# Altium schematic sheet Sheet2.0.SchDoc
size A0
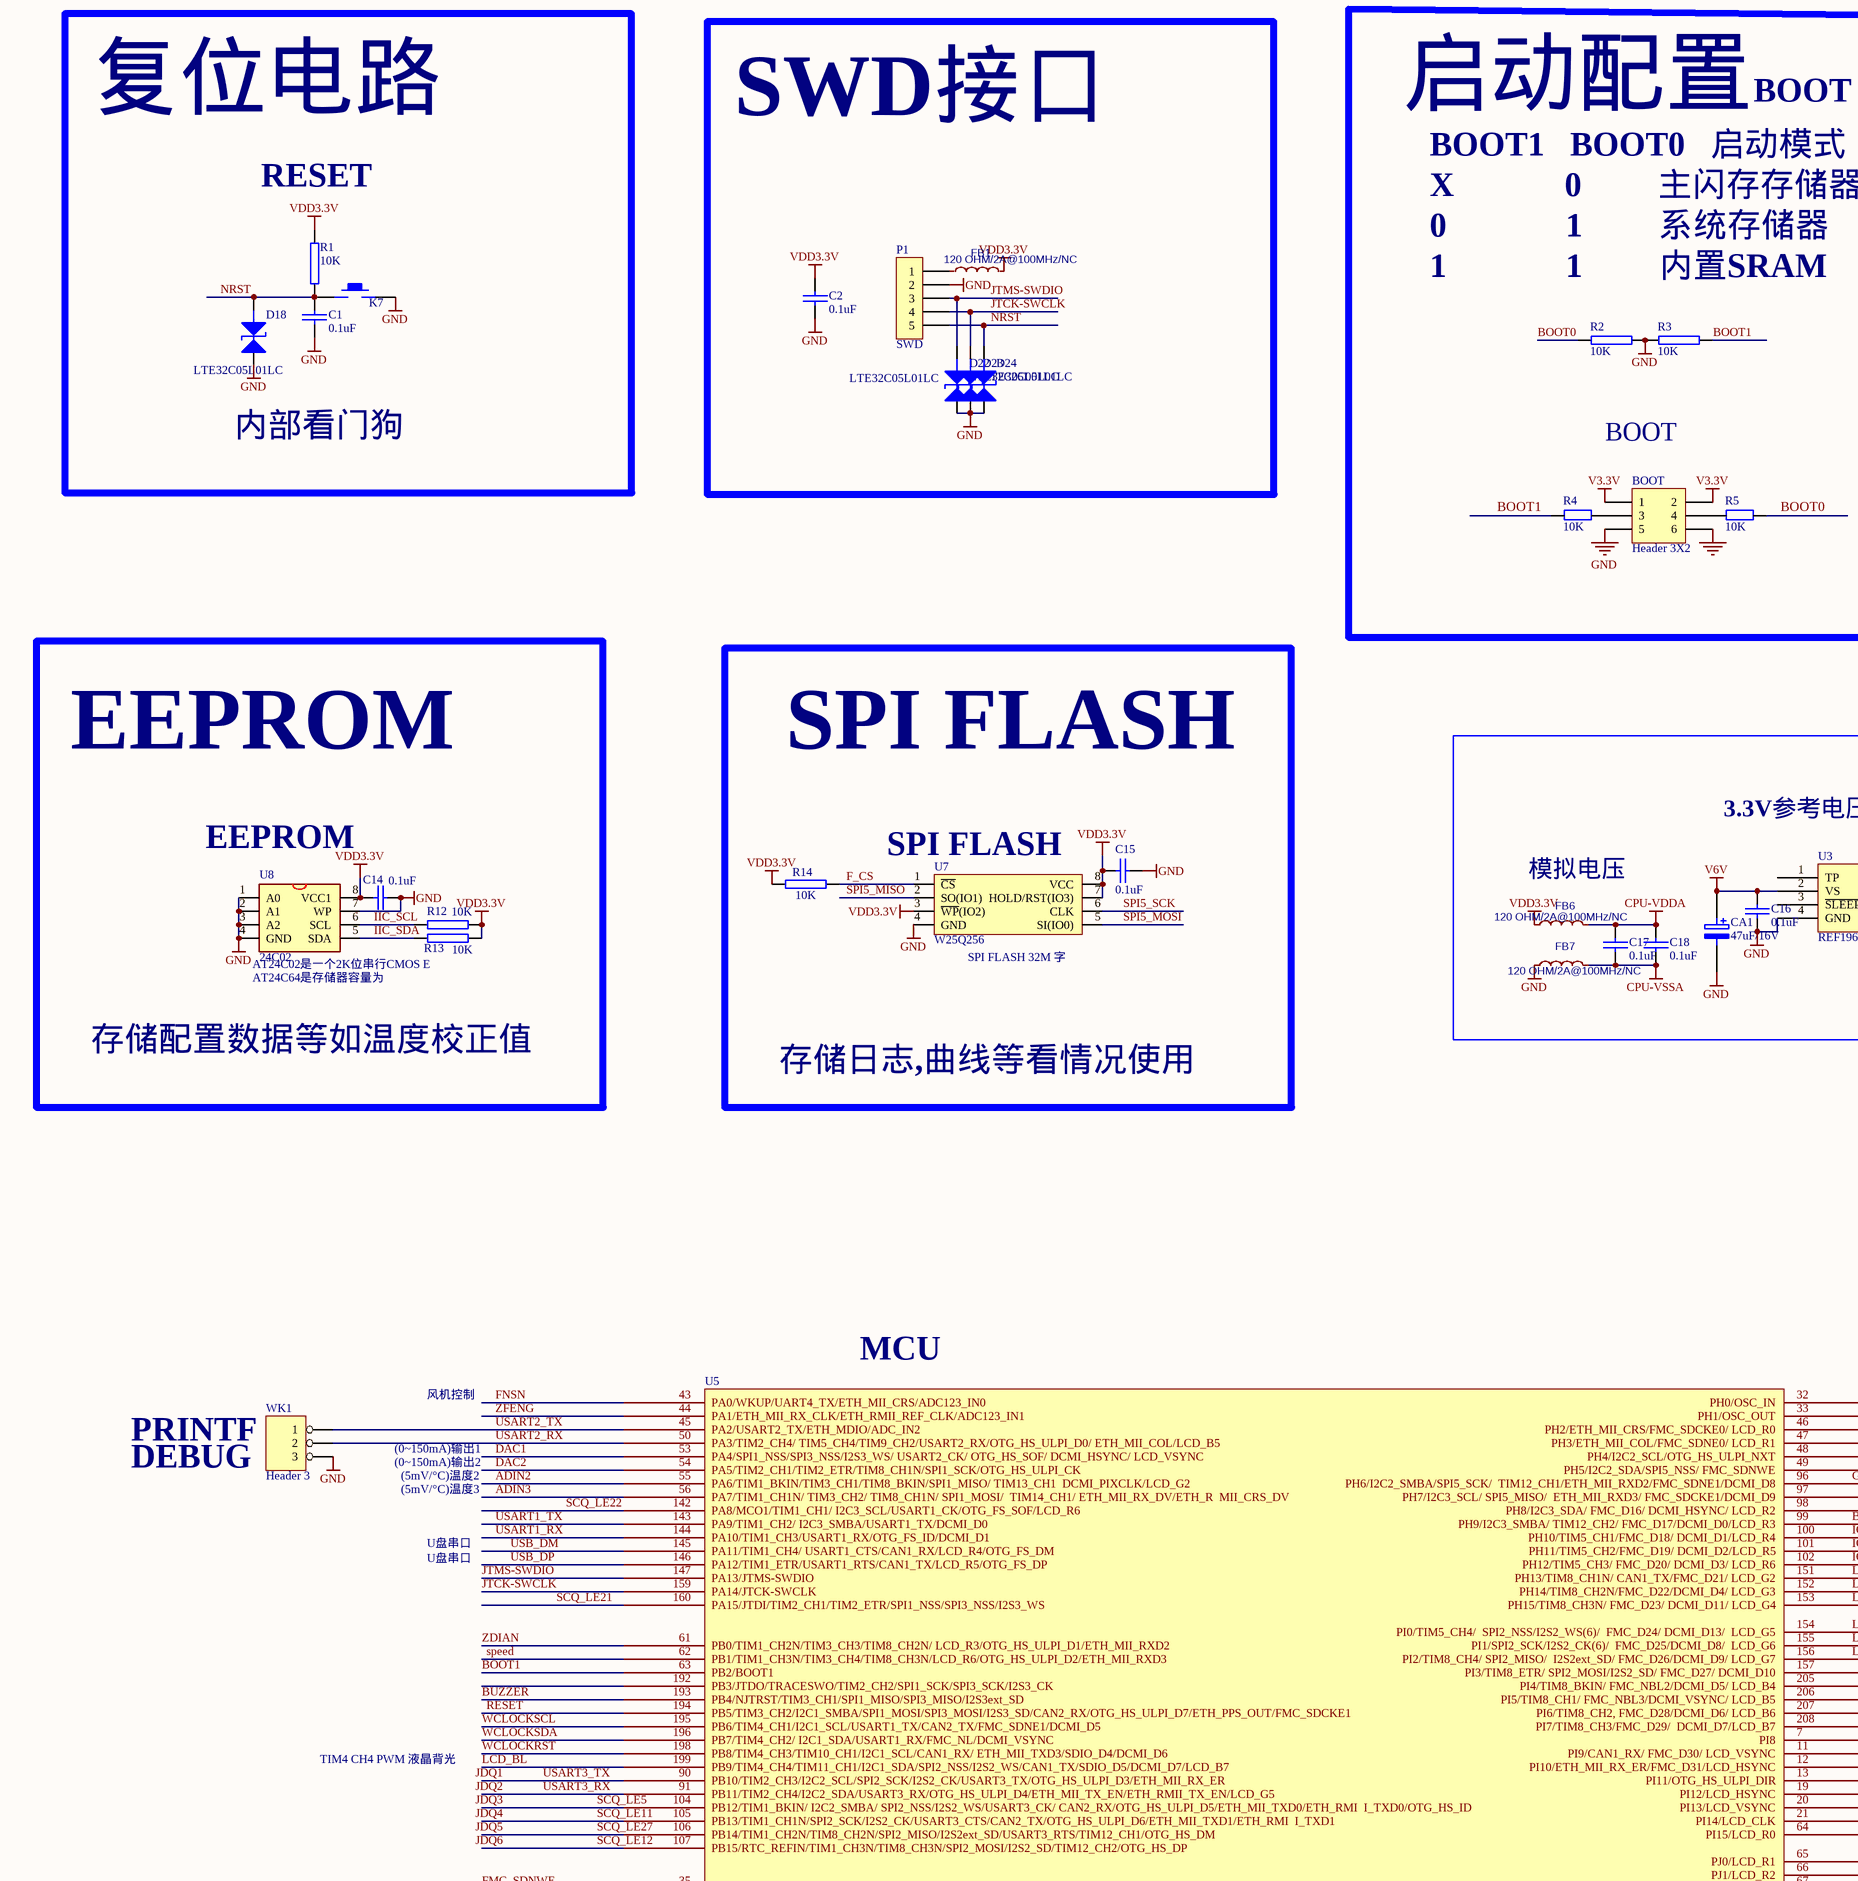
[diagram p0: Sheet2.0.SchDoc, top left]
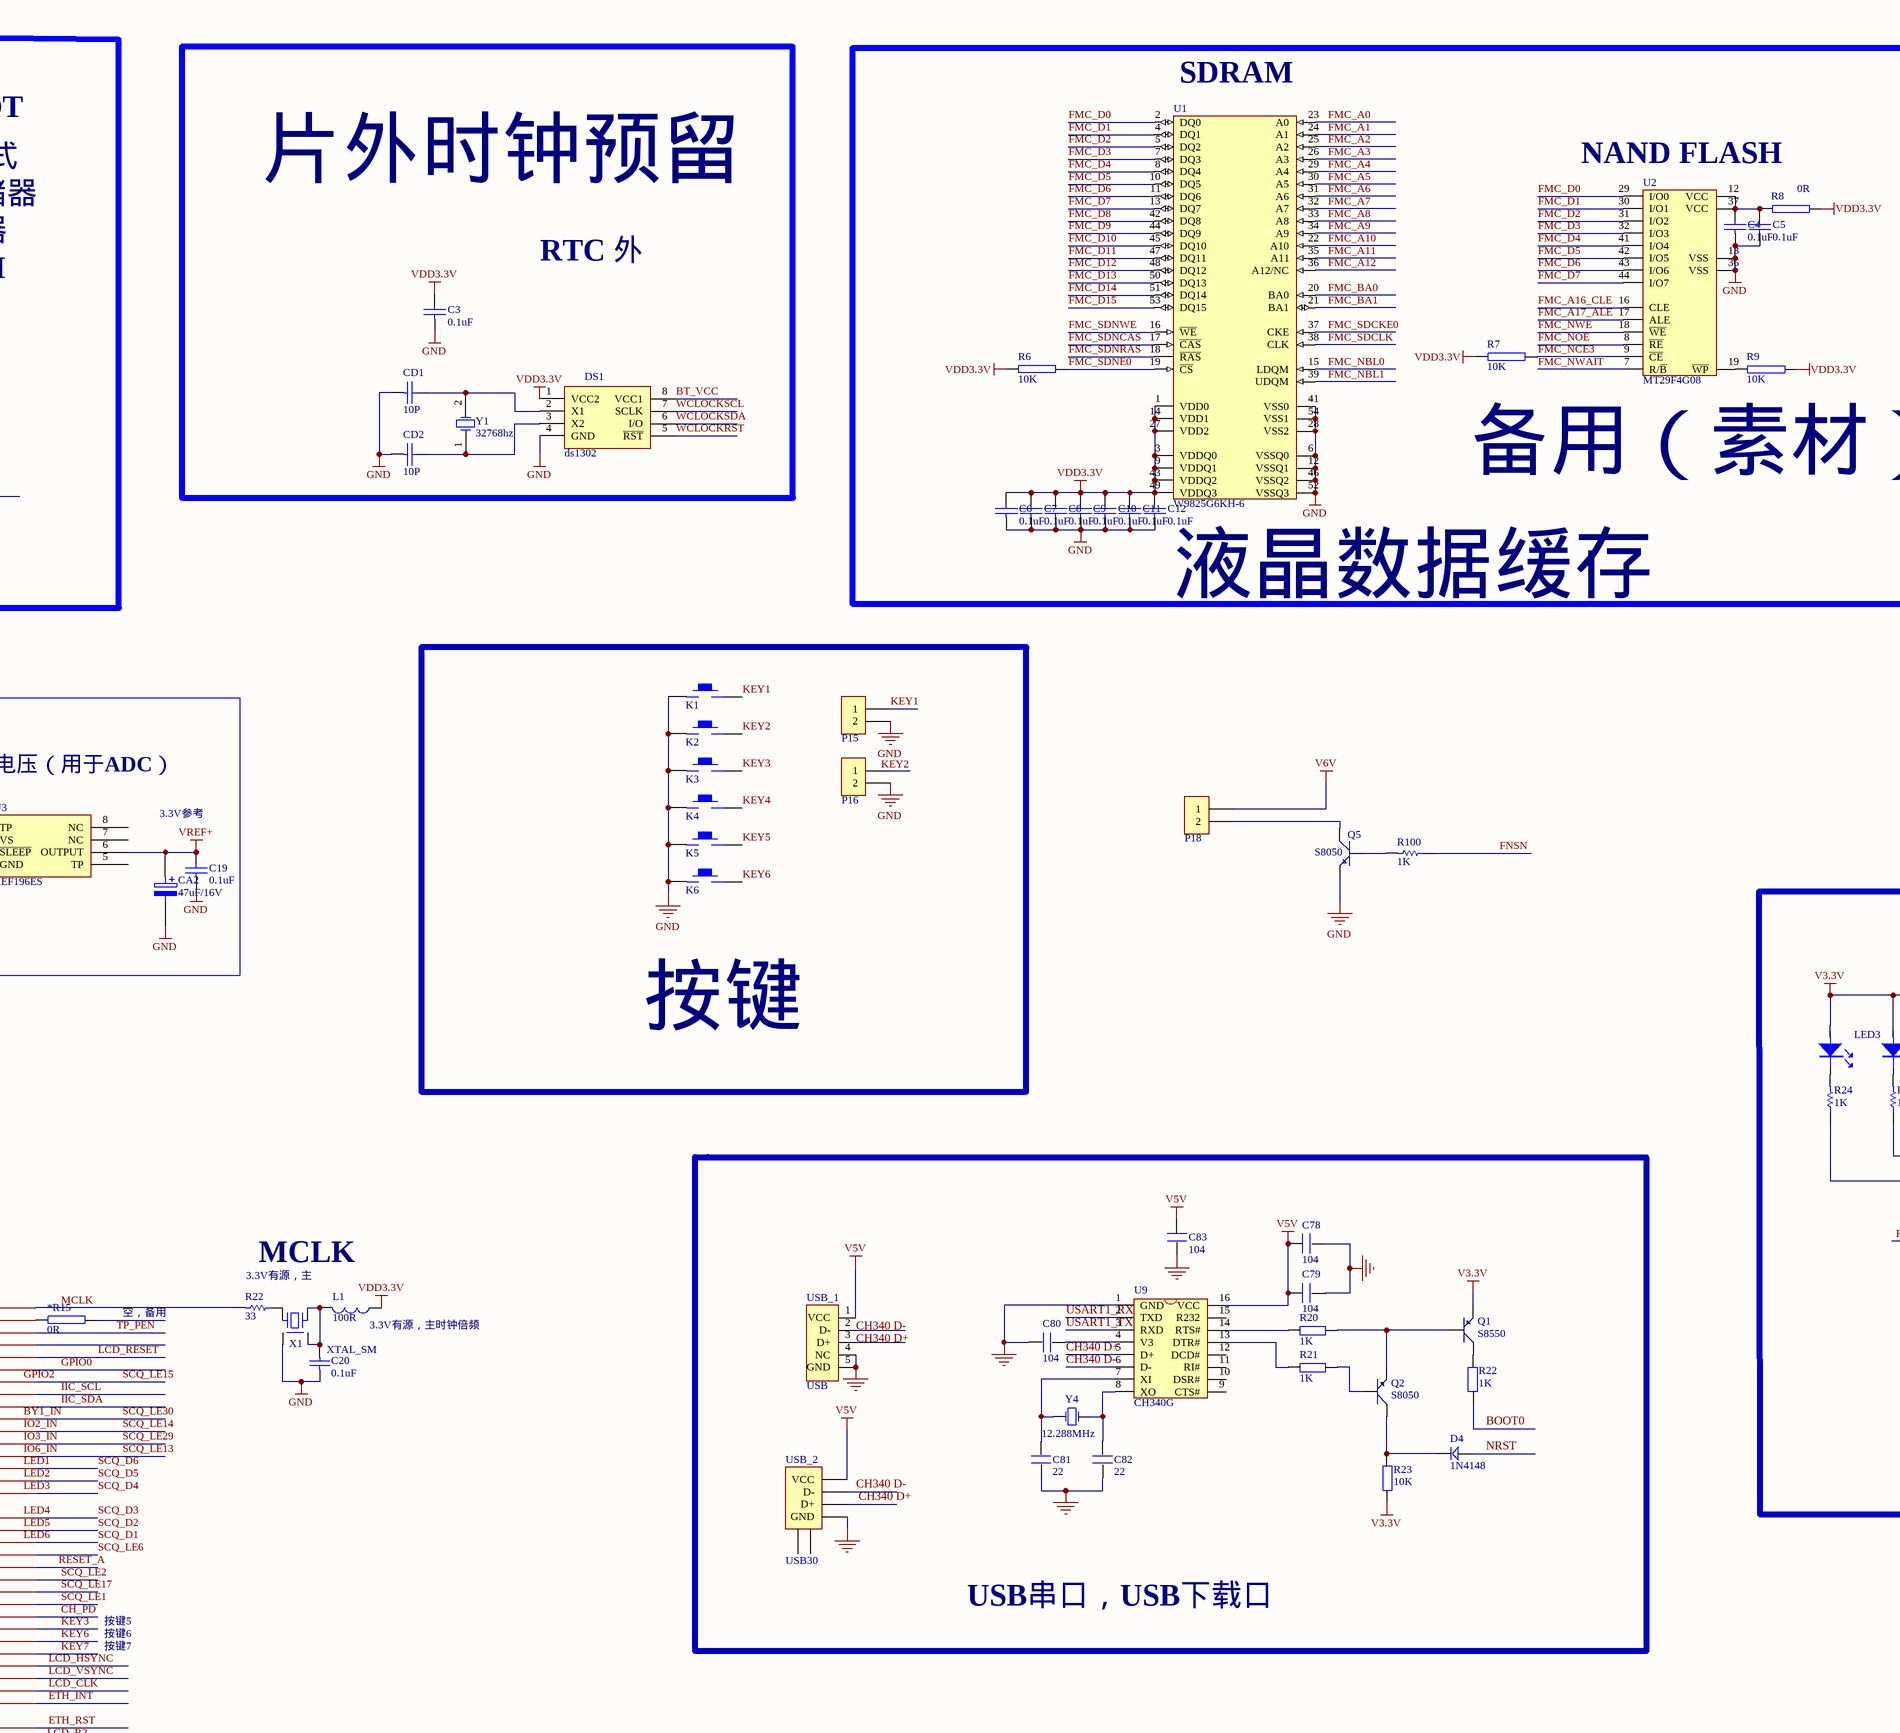
[diagram p1: Sheet2.0.SchDoc, top middle]
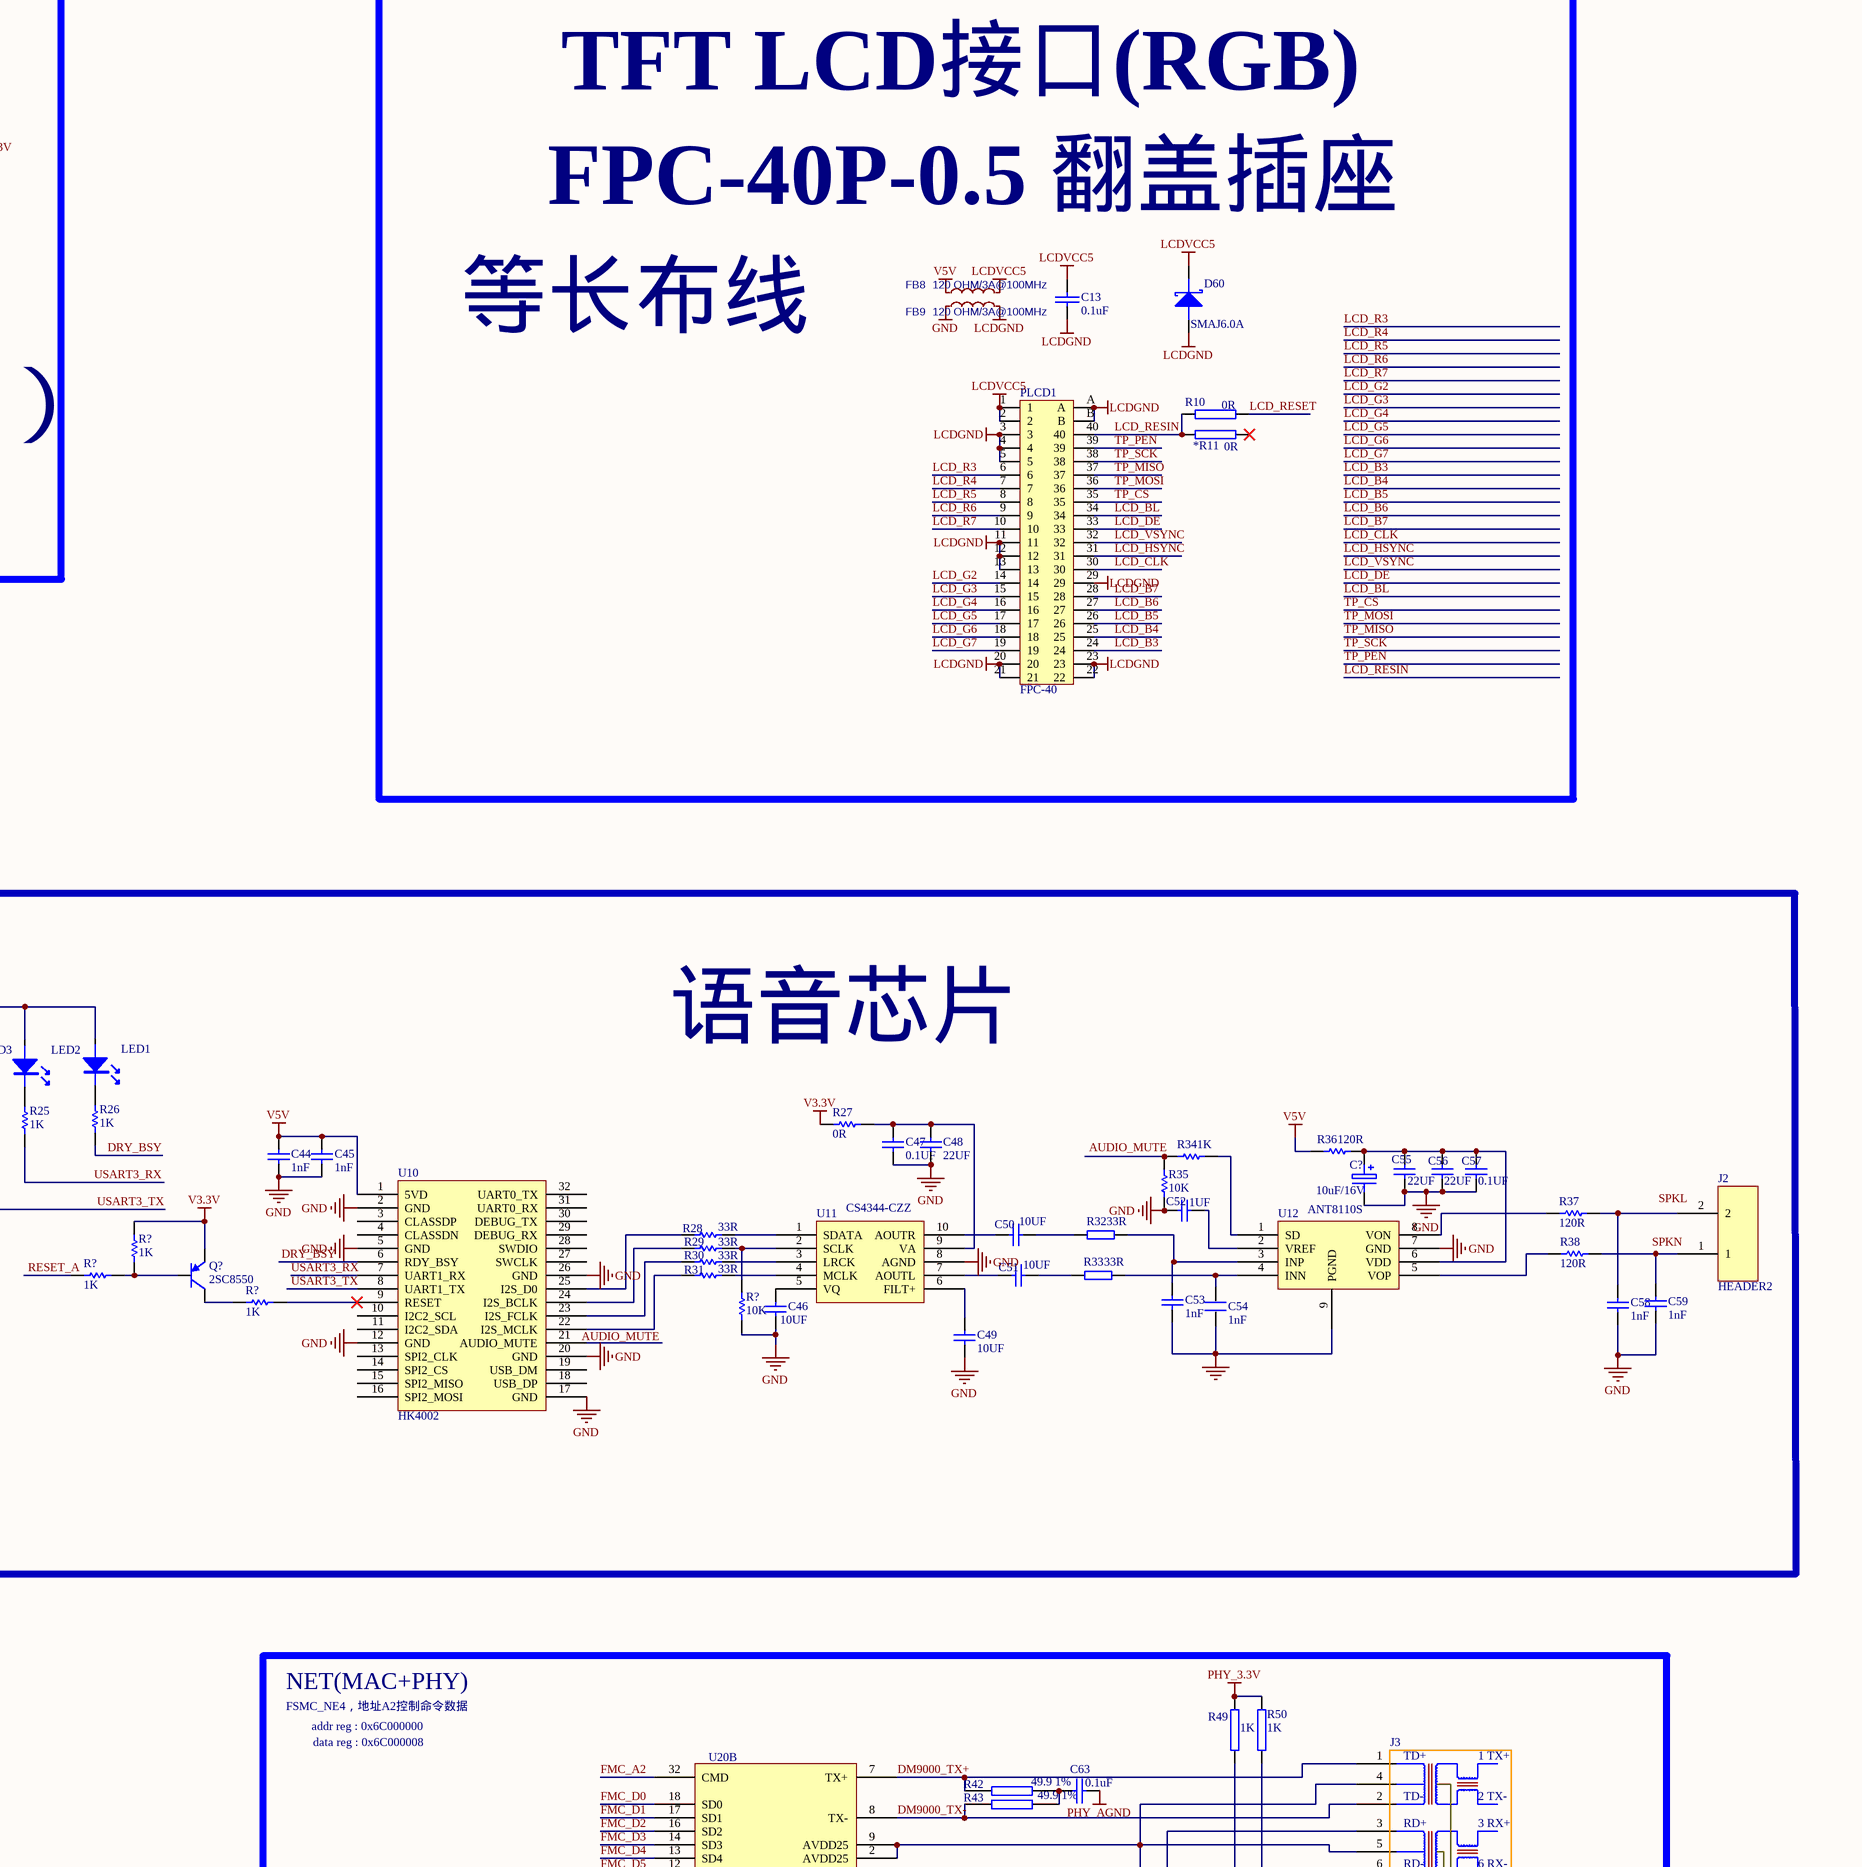
[diagram p2: Sheet2.0.SchDoc, top right]
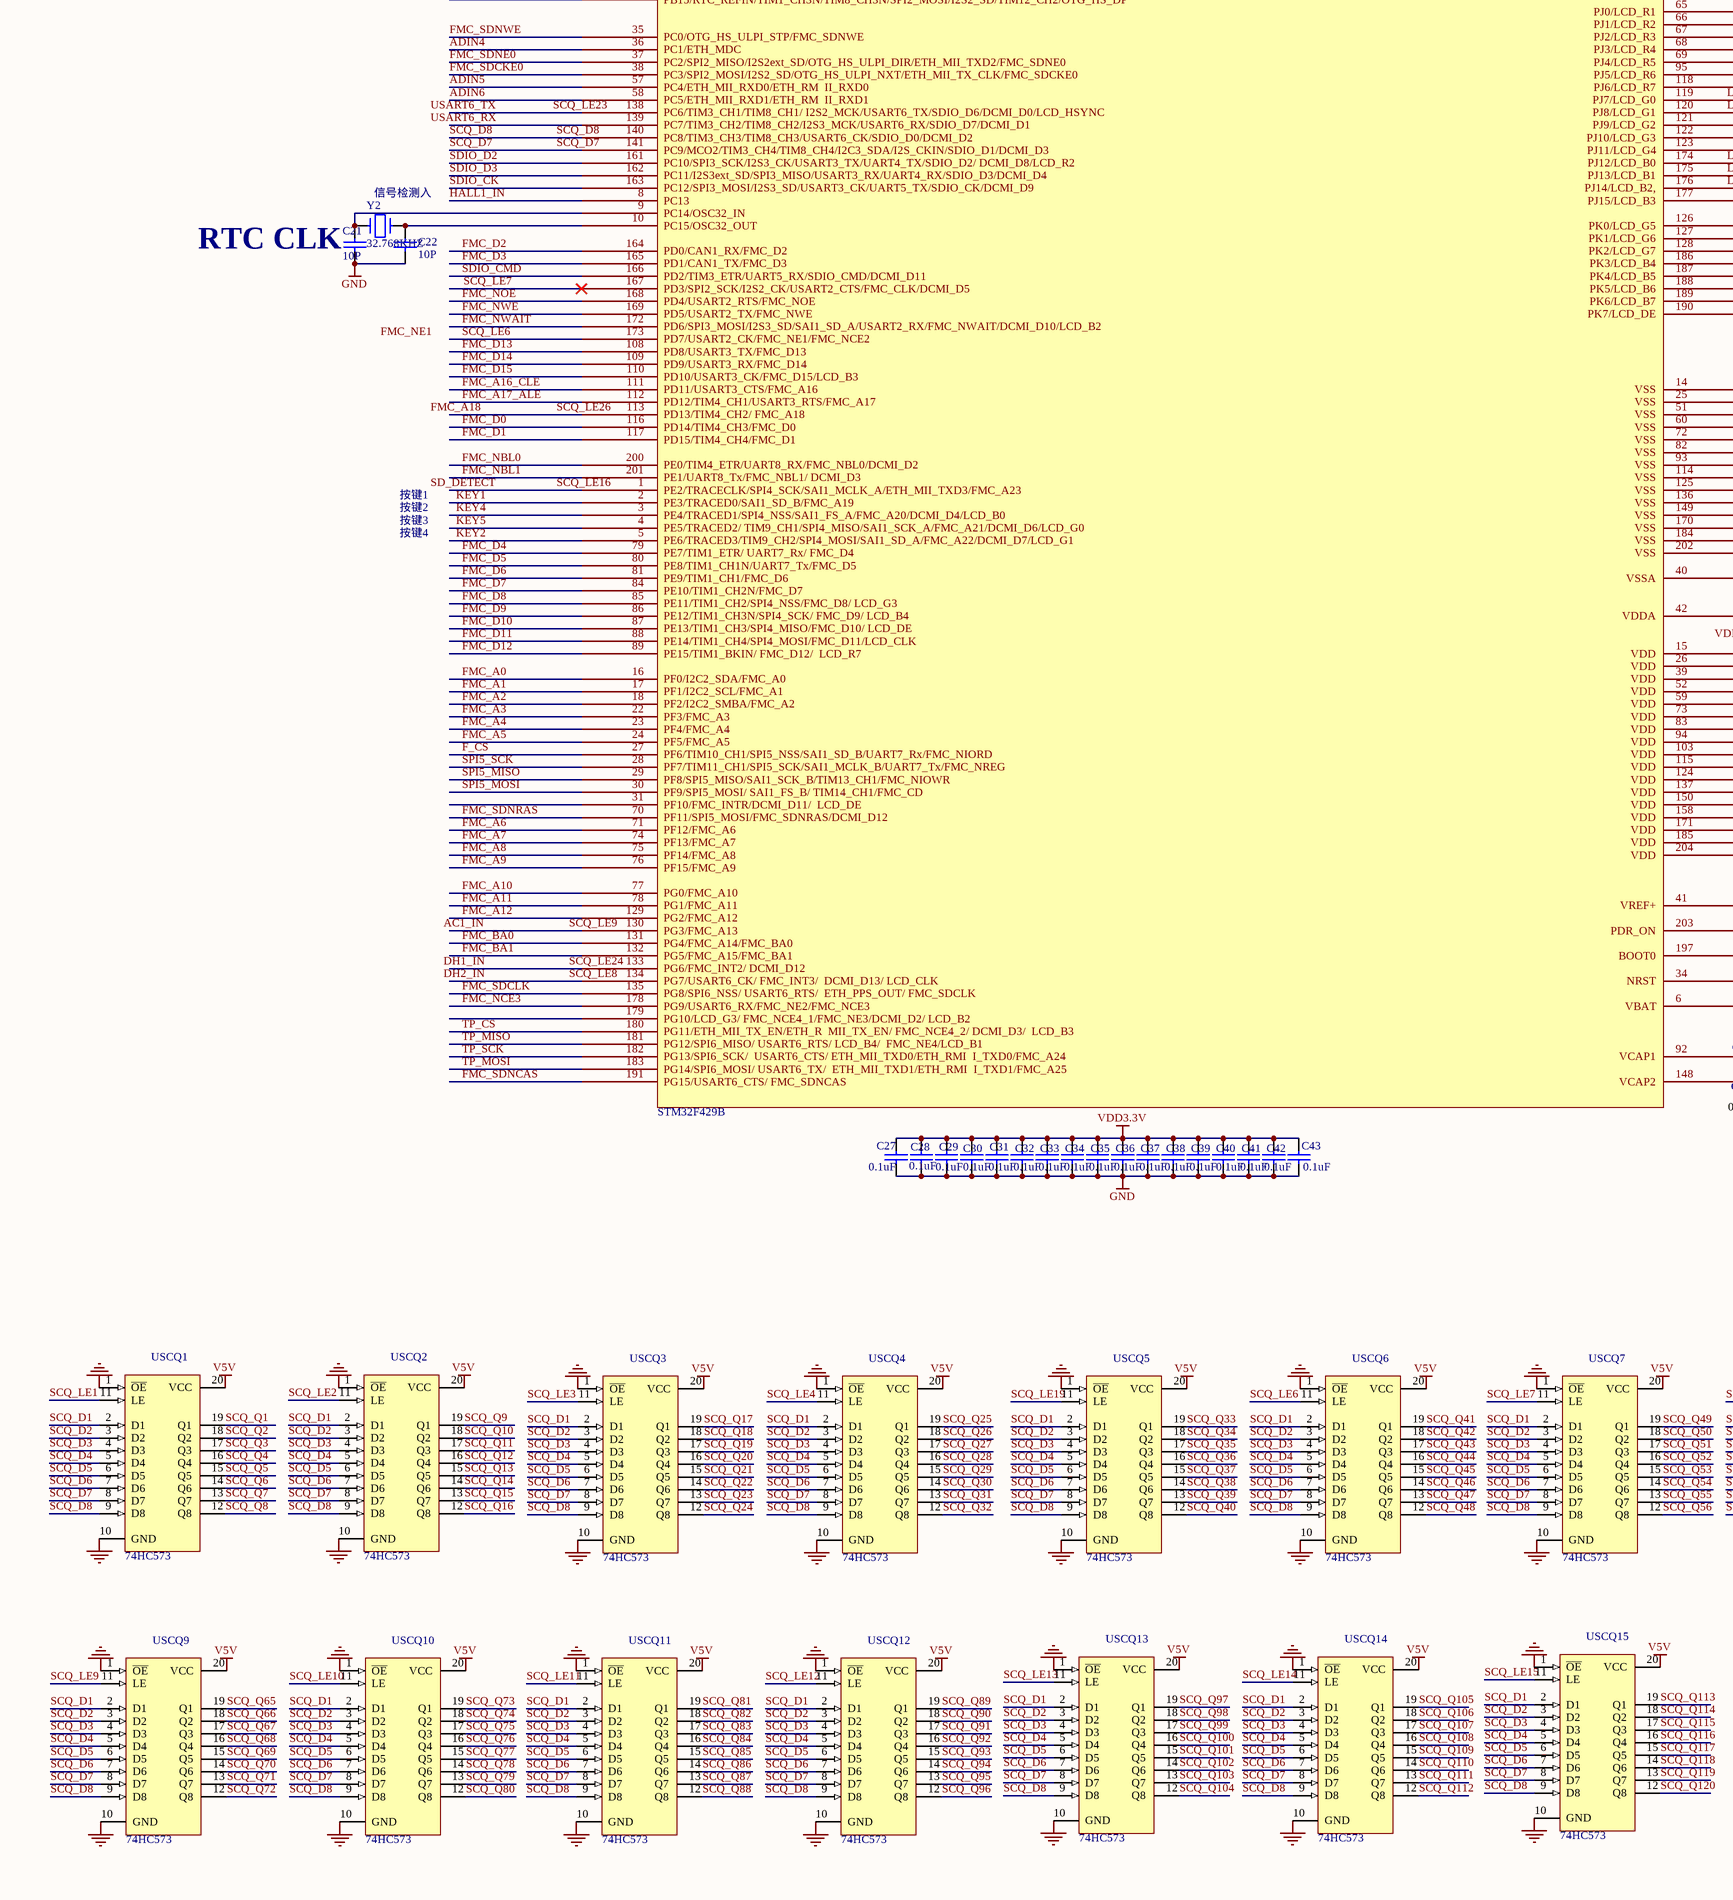
[diagram p3: Sheet2.0.SchDoc, bottom left]
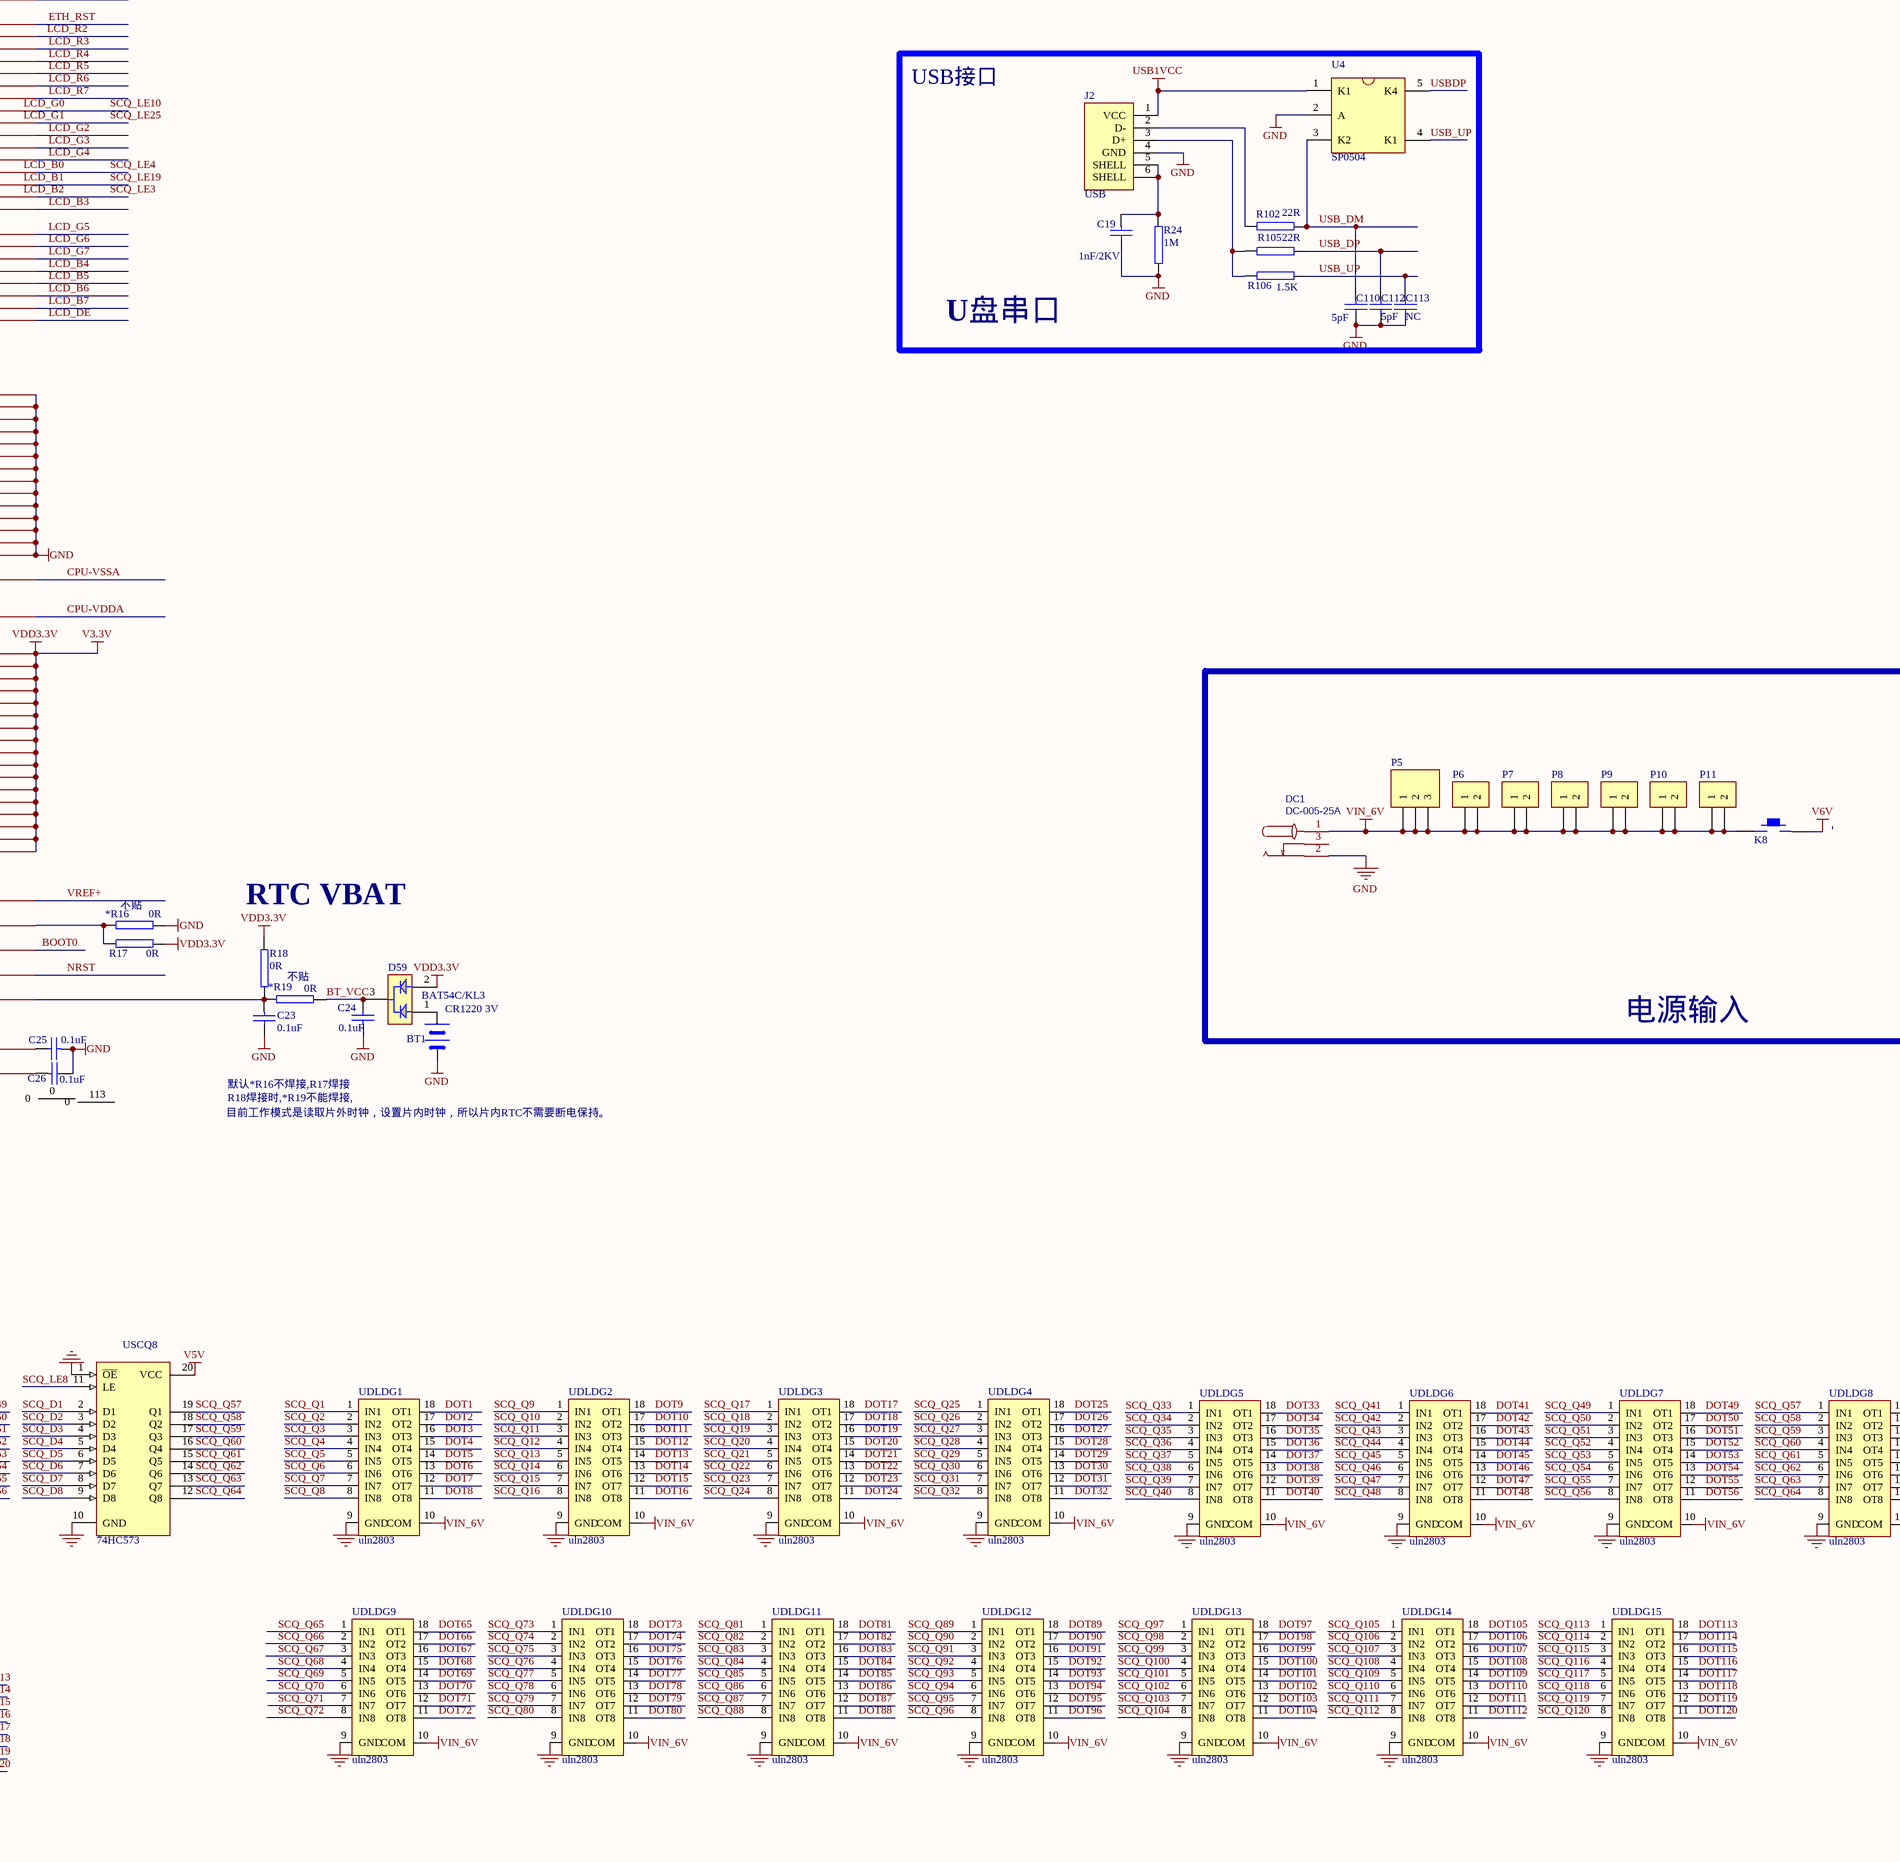
[diagram p4: Sheet2.0.SchDoc, bottom middle]
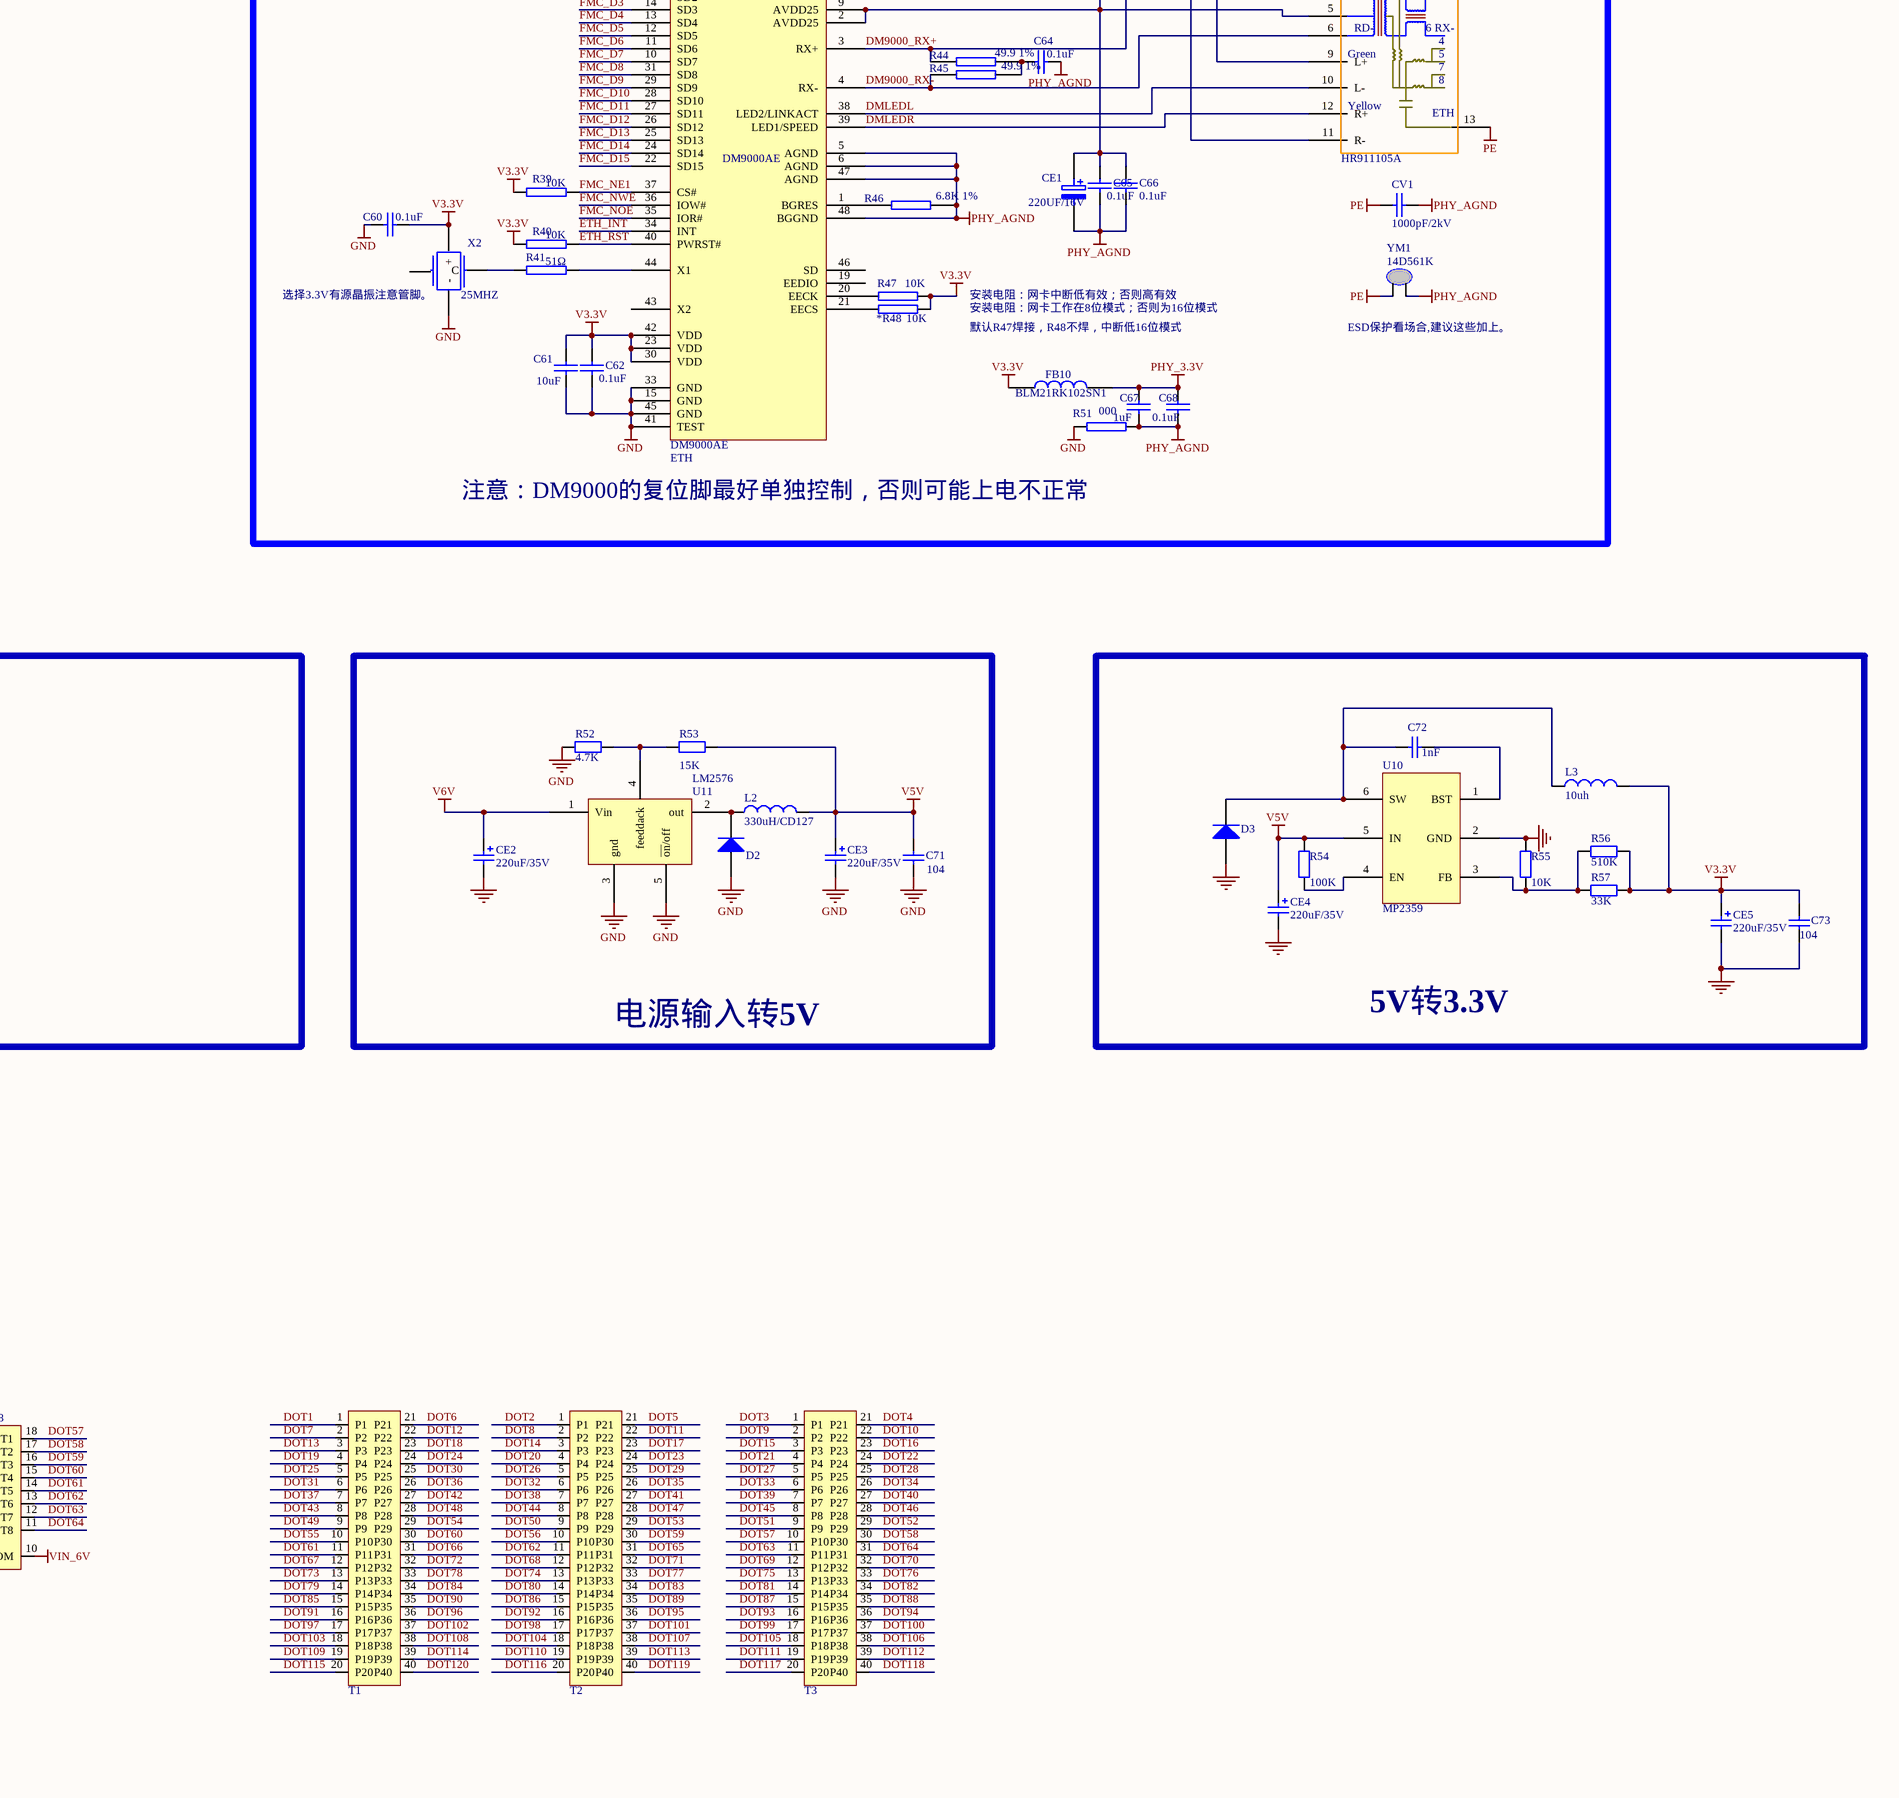
[diagram p5: Sheet2.0.SchDoc, bottom right]

## Parts
(Parts that share a designator on the sheet are numbered #1, #2 ... from top to bottom, then left to right.)
*R11  0R  [0603R]
*R15  0R  [0603R]
*R16  0R  [0603R]
*R19  0R  [0603R]
*R48  10K  [0603R]
BOOT  Header 3X2  [HDR2X3]
BT1  CR1220 3V  [CR1220-1]
C1  0.1uF  [0603C]
C2  0.1uF  [0603C]
C3  0.1uF  [0603C]
C4  0.1uF  [0603C]
C5  0.1uF  [0603C]
C6  0.1uF  [0603C]
C7  0.1uF  [0603C]
C8  0.1uF  [0603C]
C9  0.1uF  [0603C]
C10  0.1uF  [0603C]
C11  0.1uF  [0603C]
C12  0.1uF  [0603C]
C13  0.1uF  [0603C]
C14  0.1uF  [0603C]
C15  0.1uF  [0603C]
C16  0.1uF  [0603C]
C17  0.1uF  [0603C]
C18  0.1uF  [0603C]
C19#1  0.1uF  [0603C]
C19#2  1nF/2KV  [SC1206]
C20  value 0.1uF  [0603C]  (hidden comment: Cap S1)
C21  10P  [0603C]
C22  10P  [0603C]
C23  0.1uF  [0603C]
C24  0.1uF  [0603C]
C25  0.1uF  [0603C]
C26  0.1uF  [0603C]
C27  0.1uF  [0603C]
C28  0.1uF  [0603C]
C29  0.1uF  [0603C]
C30  0.1uF  [0603C]
C31  0.1uF  [0603C]
C32  0.1uF  [0603C]
C33  0.1uF  [0603C]
C34  0.1uF  [0603C]
C35  0.1uF  [0603C]
C36  0.1uF  [0603C]
C37  0.1uF  [0603C]
C38  0.1uF  [0603C]
C39  0.1uF  [0603C]
C40  0.1uF  [0603C]
C41  0.1uF  [0603C]
C42  0.1uF  [0603C]
C43  0.1uF  [0603C]
C44  value 1nF  [0603C]  (hidden comment: Cap S1)
C45  value 1nF  [0603C]  (hidden comment: Cap S1)
C46  value 10UF  [0603C]  (hidden comment: Cap S1)
C47  value 0.1UF  [0603C]  (hidden comment: Cap S1)
C48  value 22UF  [0603C]  (hidden comment: Cap S1)
C49  value 10UF  [0603C]  (hidden comment: Cap S1)
C50  value 10UF  [0603C]  (hidden comment: Cap S1)
C51  value 10UF  [0603C]  (hidden comment: Cap S1)
C52  value 1UF  [0603C]  (hidden comment: Cap S1)
C53  1nF  [0603C]
C54  1nF  [0603C]
C55  value 22UF  [0603C]  (hidden comment: Cap S1)
C56  value 22UF  [0603C]  (hidden comment: Cap S1)
C57  value 0.1UF  [0603C]  (hidden comment: Cap S1)
C58  value 1nF  [0603C]  (hidden comment: Cap S1)
C59  value 1nF  [0603C]  (hidden comment: Cap S1)
C60  0.1uF  [0603C]
C61  10uF  [0603C]
C62  0.1uF  [0603C]
C63  0.1uF  [0603C]
C64  0.1uF  [0603C]
C65  0.1uF  [0603C]
C66  0.1uF  [0603C]
C67  1uF  [0603C]
C68  0.1uF  [0603C]
C71  value 104  [0603C]
C72  value 1nF  [0603C]
C73  value 104  [0603C]
C78  104  [0603C]
C79  104  [0603C]
C80  104  [0603C]
C81  22  [0603C]
C82  22  [0603C]
C83  104  [0603C]
C110  5pF  [SC0603]
C112  5pF  [SC0603]
C113  NC  [SC0603]
C?  value 10uF/16V  [0603C-1]  (hidden comment: CAP1)
CA1  47uF/16V  [C1210]
CA2  47uF/16V  [C1210]
CD1  10P  [0603C]
CD2  10P  [0603C]
CE1  220UF/16V  [2220]
CE2  220uF/35V  [C-0808-S]
CE3  220uF/35V  [C-0808-S]
CE4  220uF/35V  [C-0808-S]
CE5  220uF/35V  [C-0808-S]
CV1  1000pF/2kV  [1210]
D2  (no value)  [DO-214AA]
D3  (no value)  [1206D-N]
D4  1N4148  [DIODE_SOP]
D18  LTE32C05L01LC  [SOD-323]
D22  LTE32C05L01LC  [SOD-323]
D23  LTE32C05L01LC  [SOD-323]
D24  LTE32C05L01LC  [SOD-323]
D59  BAT54C/KL3  [SOT-23]
D60  SMAJ6.0A  [DO-214AB]
DC1  DC-005-25A  [DC10B]
DS1  ds1302  [SO-8N]
FB1  120 OHM/2A@100MHz/NC  [SL0603]
FB6  120 OHM/2A@100MHz/NC  [SL0603]
FB7  120 OHM/2A@100MHz/NC  [SL0603]
FB8  120 OHM/3A@100MHz  [SL0805]
FB9  120 OHM/3A@100MHz  [SL0805]
FB10  BLM21RK102SN1  [0805L-1]
J2#1  HEADER2  [HDR1X2]
J2#2  USB  [USB/20]
J3  HR911105A  [HR911105A]
K1  KEY_M  [KEY_M]  (value not drawn)
K2  KEY_M  [KEY_M]  (value not drawn)
K3  KEY_M  [KEY_M]  (value not drawn)
K4  KEY_M  [KEY_M]  (value not drawn)
K5  KEY_M  [KEY_M]  (value not drawn)
K6  KEY_M  [KEY_M]  (value not drawn)
K7  KEY_M  [KEY_M]  (value not drawn)
K8  KEY_M  [BTN8.5*8.5]  (value not drawn)
L1  100R  [0603R]
L2  L1: 330uH/CD127  [L1270]
L3  L1: 10uh  [L0630]
LED1  (no value)  [1206D-N]
LED2  (no value)  [1206D-N]
LED3  (no value)  [1206D-N]
P1  SWD  [CON5_2.5_1]
P5  Header 3  [HDR1X3]  (value not drawn)
P6  CON2  [N1A]  (value not drawn)
P7  CON2  [N1A]  (value not drawn)
P8  CON2  [N1A]  (value not drawn)
P9  CON2  [N1A]  (value not drawn)
P10  CON2  [N1A]  (value not drawn)
P11  CON2  [N1A]  (value not drawn)
P15  CON2  [CON-2-2.0]  (value not drawn)
P16  CON2  [CON-2-2.0]  (value not drawn)
P18  CON2  [CON-2-2.0]  (value not drawn)
PLCD1  FPC-40  [FPC-TOP40]
Q1  S8550  [SOT-23R]
Q2  S8050  [SOT-23R]
Q5  S8050  [SOT-23A]
Q?  2SC8550  [SOT-23A]
R1  10K  [0603R]
R2  10K  [0603R]
R3  10K  [0603R]
R4  10K  [0603R]
R5  10K  [0603R]
R6  10K  [0603R]
R7  10K  [0603R]
R8  0R  [0603R]
R9  10K  [0603R]
R10  0R  [0603R]
R12  10K  [0603R]
R13  10K  [0603R]
R14  10K  [0603R]
R17  0R  [0603R]
R18  0R  [0603R]
R20  1K  [0603R]
R21  1K  [0603R]
R22#1  1K  [0603R]
R22#2  value 33  [0603R]  (hidden comment: R1-S)
R23  10K  [0603R]
R24#1  value 1K  [0603R]  (hidden comment: R1-S)
R24#2  1M  [SR1206]
R25  value 1K  [0603R]  (hidden comment: R1-S)
R26  value 1K  [0603R]  (hidden comment: R1-S)
R27  value 0R  [0603R]  (hidden comment: R1-S)
R28  value 33R  [0603R]  (hidden comment: R1-S)
R29  value 33R  [0603R]  (hidden comment: R1-S)
R30  value 33R  [0603R]  (hidden comment: R1-S)
R31  value 33R  [0603R]  (hidden comment: R1-S)
R32  33R  [0603R]
R33  33R  [0603R]
R34  value 1K  [0603R]  (hidden comment: R1-S)
R35  value 10K  [0603R]  (hidden comment: R1-S)
R36  value 120R  [0603R]  (hidden comment: R1-S)
R37  value 120R  [0603R]  (hidden comment: R1-S)
R38  value 120R  [0603R]  (hidden comment: R1-S)
R39  10K  [0603R]
R40  10K  [0603R]
R41  51Ω  [0603R]
R42  49.9 1%  [0603R]
R43  49.9 1%  [0603R]
R44  49.9 1%  [0603R]
R45  49.9 1%  [0603R]
R46  6.8K 1%  [0603R]
R47  10K  [0603R]
R49  1K  [0603R]
R50  1K  [0603R]
R51  000  [0603R]
R52  value 4.7K  [0603R]
R53  value 15K  [0603R]
R54  value 100K  [0603R]
R55  value 10K  [0603R]
R56  value 510K  [0603R]
R57  value 33K  [0603R]
R100  value 1K  [0603R]  (hidden comment: R1-S)
R102  22R  [0603R]
R105  22R  [0603R]
R106  1.5K  [0603R]
R?#1  value 1K  [0201]  (hidden comment: R1-S)
R?#2  value 1K  [0201]  (hidden comment: R1-S)
R?#3  value 1K  [0201]  (hidden comment: R1-S)
R?#4  value 10K  [0603R]  (hidden comment: R1-S)
T1  dubangxian  [杜邦线插脚]  (value not drawn)
T2  dubangxian  [杜邦线插脚]  (value not drawn)
T3  dubangxian  [杜邦线插脚]  (value not drawn)
U1  W9825G6KH-6  [TSOP54]
U2  MT29F4G08  [TSOP48]
U3  REF196ES  [SO-8N]
U4  SP0504  [SC70-5]
U5  STM32F429B  [STM32F429_LQFP208]
U7  W25Q256  [SOP8-K]
U8  24C02  [SO-8N]
U9  CH340G  [SOP16M]
U10#1  HK4002  [HK4002]
U10#2  MP2359  [SOT-26A]
U11#1  CS4344-CZZ  [TSSOP-10]
U11#2  LM2576  [TO-263]
U12  ANT8110S  [SOP-8NT]
U20  DM9000AE  [DM9000AE]  (part B of 2)
UDLDG1  uln2803  [sol-18]
UDLDG2  uln2803  [sol-18]
UDLDG3  uln2803  [sol-18]
UDLDG4  uln2803  [sol-18]
UDLDG5  uln2803  [sol-18]
UDLDG6  uln2803  [sol-18]
UDLDG7  uln2803  [sol-18]
UDLDG8  uln2803  [sol-18]
UDLDG9  uln2803  [sol-18]
UDLDG10  uln2803  [sol-18]
UDLDG11  uln2803  [sol-18]
UDLDG12  uln2803  [sol-18]
UDLDG13  uln2803  [sol-18]
UDLDG14  uln2803  [sol-18]
UDLDG15  uln2803  [sol-18]
USB_1  USB  [USB/SM0.8-6H5]
USB_2  USB30  [USB/30]
USCQ1  74HC573  [SO20_M]
USCQ2  74HC573  [SO20_M]
USCQ3  74HC573  [SO20_M]
USCQ4  74HC573  [SO20_M]
USCQ5  74HC573  [SO20_M]
USCQ6  74HC573  [SO20_M]
USCQ7  74HC573  [SO20_M]
USCQ8  74HC573  [SO20_M]
USCQ9  74HC573  [SO20_M]
USCQ10  74HC573  [SO20_M]
USCQ11  74HC573  [SO20_M]
USCQ12  74HC573  [SO20_M]
USCQ13  74HC573  [SO20_M]
USCQ14  74HC573  [SO20_M]
USCQ15  74HC573  [SO20_M]
WK1  Header 3  [CON-3-2.5]
X1  XTAL_SM  [X5032-1]
X2  25MHZ  [X5032-1]
Y1  32768hz  [XTAL-3215]
Y2  32.768KHZ  [XTAL-3215]
Y4  12.288MHz  [XTAL_US]
YM1  14D561K  [YM14D-1]

## Blocks framed on the sheet
启动配置: BOOT R2-R5
复位电路: C1 D18 K7 R1
SWD接口: C2 D22-D24 FB1 P1
片外时钟预留: C3 CD1 CD2 DS1 Y1
备用（素材）: C4-C12 R6-R9 U1 U2
EEPROM: C14 R12 R13 U8
SPI FLASH: C15 R14 U7
按键: K1-K6 P15 P16
语音芯片: C44-C59 C? J2#1 LED1-LED3 Q? R24#1 R25-R38 R?#1-R?#4 U10#1 U11#1 U12
U盘串口: C19#2 C110 C112 C113 J2#2 R24#2 R102 R105 R106 U4
电源输入: DC1 K8 P5-P11
电源输入转5V: C71 CE2 CE3 D2 L2 R52 R53 U11#2
5V转3.3V: C72 C73 CE4 CE5 D3 L3 R54-R57 U10#2

## Nets
1: X2.1
CPU-VDDA: C17.2 C18.2 FB6.2 U5.42(VDDA)
CPU-VSSA: C17.1 C18.1 FB7.2 U5.40(VSSA)
GND: *R16.1 BOOT.5 BOOT.6 BT1.2 C1.1 C2.1 C3.1 C4.1 C5.1 C6.1 C7.1 C8.1 C9.1 C10.1 C11.1 C12.1 C14.1 C15.1 C16.1 C19#1.1 C19#2.2 C20.2 C21.1 C22.2 C23.2 C24.1 C25.1 C26.2 C27.1 C28.1 C29.1 C30.1 C31.1 C32.1 C33.1 C34.1 C35.1 C36.1 C37.1 C38.1 C39.1 C40.1 C41.1 C42.1 C43.1 C44.1 C45.1 C46.1 C47.1 C48.1 C49.1 C52.1 C53.2 C54.2 C55.1 C56.1 C57.1 C58.1 C59.1 C60.2 C61.1 C62.2 C71.2 C73.2 C78.2 C79.2 C80.1 C81.1 C82.1 C83.1 C110.2 C112.2 C113.2 C?.2 CA1.2 CA2.2 CD1.1 CD2.1 CE2.2 CE3.2 CE4.2 CE5.2 D2.1(A) D3.1(A) D18.2(K) D22.2(K) D23.2(K) D24.2(K) DC1.2 DS1.4(GND) FB7.1 FB9.1 J2#2.4(GND) K1.1 K2.1 K3.1 K4.1 K5.1 K6.1 K7.2 P1.2 P15.2 P16.2 Q5.1(E) R2.1 R3.1 R24#2.2 R35.1 R51.2 R52.2 R55.2 R?#4.1 U1.6(VSSQ0) U1.12(VSSQ1) U1.28(VSS2) U1.41(VSS0) U1.46(VSSQ2) U1.52(VSSQ3) U1.54(VSS1) U2.13(VSS) U2.36(VSS) U3.4(GND) U4.2(A) U5.14(VSS) U5.25(VSS) U5.51(VSS) U5.60(VSS) U5.72(VSS) U5.82(VSS) U5.93(VSS) U5.114(VSS) U5.125(VSS) U5.136(VSS) U5.149(VSS) U5.170(VSS) U5.184(VSS) U5.202(VSS) U7.4(GND) U8.1(A0) U8.2(A1) U8.3(A2) U8.4(GND) U8.7(WP) U9.1(GND) U10#1.2(GND) U10#1.5(GND) U10#1.12(GND) U10#1.17(GND) U10#1.20(GND) U10#1.26(GND) U10#2.2(GND) U11#1.8(AGND) U11#2.3(gnd) U11#2.5(~{on}/off) U12.7(GND) U12.9(PGND) U20.15(GND) U20.33(GND) U20.41(TEST) U20.45(GND) UDLDG1.9(GND) UDLDG2.9(GND) UDLDG3.9(GND) UDLDG4.9(GND) UDLDG5.9(GND) UDLDG6.9(GND) UDLDG7.9(GND) UDLDG8.9(GND) UDLDG9.9(GND) UDLDG10.9(GND) UDLDG11.9(GND) UDLDG12.9(GND) UDLDG13.9(GND) UDLDG14.9(GND) UDLDG15.9(GND) USB_1.4(NC) USB_1.5(GND) USB_2.4(GND) USCQ1.1(~{OE}) USCQ1.10(GND) USCQ2.1(~{OE}) USCQ2.10(GND) USCQ3.1(~{OE}) USCQ3.10(GND) USCQ4.1(~{OE}) USCQ4.10(GND) USCQ5.1(~{OE}) USCQ5.10(GND) USCQ6.1(~{OE}) USCQ6.10(GND) USCQ7.1(~{OE}) USCQ7.10(GND) USCQ8.1(~{OE}) USCQ8.10(GND) USCQ9.1(~{OE}) USCQ9.10(GND) USCQ10.1(~{OE}) USCQ10.10(GND) USCQ11.1(~{OE}) USCQ11.10(GND) USCQ12.1(~{OE}) USCQ12.10(GND) USCQ13.1(~{OE}) USCQ13.10(GND) USCQ14.1(~{OE}) USCQ14.10(GND) USCQ15.1(~{OE}) USCQ15.10(GND) WK1.3 X1.2(GND) X2.2(-)
LCDGND: C13.1 D60.1(A) FB9.2 PLCD1.3 PLCD1.4 PLCD1.5 PLCD1.11 PLCD1.12 PLCD1.13 PLCD1.20 PLCD1.21 PLCD1.22 PLCD1.23 PLCD1.29 PLCD1.A PLCD1.B
LCDVCC5: C13.2 D60.2(K) FB8.2 PLCD1.1 PLCD1.2
PE: CV1.1 J3.13 YM1.1
PHY_3.3V: C67.2 C68.2 FB10.2 R49.2 R50.2
PHY_AGND: C63.1 C64.1 C65.1 C66.1 C67.1 C68.1 CE1.2 CV1.2 R46.1 R51.1 U20.5(AGND) U20.6(AGND) U20.47(AGND) U20.48(BGGND) YM1.2
USB1VCC: J2#2.1(VCC) U4.1(K1)
V3.3V: *R48.2 BOOT.1 BOOT.2 C2.2 C3.2 C6.2 C7.2 C8.2 C9.2 C10.2 C11.2 C12.2 C14.2 C15.2 C27.2 C28.2 C29.2 C30.2 C31.2 C32.2 C33.2 C34.2 C35.2 C36.2 C37.2 C38.2 C39.2 C40.2 C41.2 C42.2 C43.2 C60.2 C61.2 C62.2 C73.1 CE5.1 D59.2 DS1.1(VCC2) FB1.2 FB6.1 FB10.1 L1.1 L3.2 LED1.1 LED2.1 LED3.1 Q1.1(E) Q?.2(E) R1.1 R6.2 R7.2 R8.2 R9.2 R12.1 R13.1 R14.1 R17.1 R18.1 R23.1 R27.1 R39.1 R40.1 R47.2 R56.1 R57.1 R?#1.2 U1.1(VDD0) U1.3(VDDQ0) U1.9(VDDQ1) U1.14(VDD1) U1.27(VDD2) U1.43(VDDQ2) U1.49(VDDQ3) U5.15(VDD) U5.26(VDD) U5.39(VDD) U5.52(VDD) U5.59(VDD) U5.73(VDD) U5.83(VDD) U5.94(VDD) U5.103(VDD) U5.115(VDD) U5.124(VDD) U5.137(VDD) U5.150(VDD) U5.158(VDD) U5.171(VDD) U5.185(VDD) U5.204(VDD) U7.3(~{WP}(IO2)) U7.7(HOLD/RST(IO3)) U7.8(VCC) U8.8(VCC1) U20.23(VDD) U20.30(VDD) U20.42(VDD) X2.4(+)  [also labelled VDD3.3V]
V5V: C44.2 C45.2 C71.1 C78.1 C79.1 C83.2 CE3.1 CE4.1 FB8.1 L2.1 R36.2 R53.2 R54.2 U9.16(VCC) U10#1.1(5VD) U10#2.5(IN) USB_1.1(VCC) USB_2.1(VCC) USCQ1.20(VCC) USCQ2.20(VCC) USCQ3.20(VCC) USCQ4.20(VCC) USCQ5.20(VCC) USCQ6.20(VCC) USCQ7.20(VCC) USCQ8.20(VCC) USCQ9.20(VCC) USCQ10.20(VCC) USCQ11.20(VCC) USCQ12.20(VCC) USCQ13.20(VCC) USCQ14.20(VCC) USCQ15.20(VCC)
V6V: C16.2 CA1.1 CE2.1 K8.5 P18.1 U3.2(VS) U11#2.1(Vin)
VIN_6V: DC1.1 K8.6 P5.1 P5.2 P5.3 P6.1 P6.2 P7.1 P7.2 P8.1 P8.2 P9.1 P9.2 P10.1 P10.2 P11.1 P11.2 UDLDG1.10(COM) UDLDG2.10(COM) UDLDG3.10(COM) UDLDG4.10(COM) UDLDG5.10(COM) UDLDG6.10(COM) UDLDG7.10(COM) UDLDG8.10(COM) UDLDG9.10(COM) UDLDG10.10(COM) UDLDG11.10(COM) UDLDG12.10(COM) UDLDG13.10(COM) UDLDG14.10(COM) UDLDG15.10(COM)
VREF+: C19#1.2 CA2.1 U3.6(OUTPUT) U5.41(VREF+)
ADIN2: U5.55(PA6/TIM1_BKIN/TIM3_CH1/TIM8_BKIN/SPI1_MISO/_TIM13_CH1__DCMI_PIXCLK/LCD_G2)
ADIN3: U5.56(PA7/TIM1_CH1N/_TIM3_CH2/_TIM8_CH1N/_SPI1_MOSI/__TIM14_CH1/_ETH_MII_RX_DV/ETH_R__MII_CRS_DV)
ADIN4: U5.36(PC1/ETH_MDC)
ADIN5: U5.57(PC4/ETH_MII_RXD0/ETH_RM__II_RXD0)
ADIN6: U5.58(PC5/ETH_MII_RXD1/ETH_RM__II_RXD1)
BOOT0: R2.2 R5.1 R22#1.2 U5.197(BOOT0)
BOOT1: R3.2 R4.2 U5.63(PB2/BOOT1)
BT_VCC: *R19.1 C24.2 D59.3 DS1.8(VCC1)
BUZZER: U5.193(PB4/NJTRST/TIM3_CH1/SPI1_MISO/SPI3_MISO/I2S3ext_SD)
CH340 D+: U9.5(D+) USB_2.3(D+)
CH340 D-: U9.6(D-) USB_2.2(D-)
CH_PD: U5.7(PI8)
DAC1: U5.53(PA4/SPI1_NSS/SPI3_NSS/I2S3_WS/_USART2_CK/_OTG_HS_SOF/_DCMI_HSYNC/_LCD_VSYNC)
DAC2: U5.54(PA5/TIM2_CH1/TIM2_ETR/TIM8_CH1N/SPI1_SCK/OTG_HS_ULPI_CK)
DM9000_RX+: J3.3 R44.2 U20.3(RX+)
DM9000_RX-: J3.6 R45.2 U20.4(RX-)
DM9000_TX+: J3.1 R42.2 U20.7(TX+)
DM9000_TX-: J3.2 R43.2 U20.8(TX-)
DMLEDL: J3.10(L-) U20.38(LED2/LINKACT)
DMLEDR: J3.12(R+) U20.39(LED1/SPEED)
DOT1: T1.1(P1) UDLDG1.18(OT1)
DOT2: T2.1(P1) UDLDG1.17(OT2)
DOT3: T3.1(P1) UDLDG1.16(OT3)
DOT4: T3.21(P21) UDLDG1.15(OT4)
DOT5: T2.21(P21) UDLDG1.14(OT5)
DOT6: T1.21(P21) UDLDG1.13(OT6)
DOT7: T1.2(P2) UDLDG1.12(OT7)
DOT8: T2.2(P2) UDLDG1.11(OT8)
DOT9: T3.2(P2) UDLDG2.18(OT1)
DOT10: T3.22(P22) UDLDG2.17(OT2)
DOT11: T2.22(P22) UDLDG2.16(OT3)
DOT12: T1.22(P22) UDLDG2.15(OT4)
DOT13: T1.3(P3) UDLDG2.14(OT5)
DOT14: T2.3(P3) UDLDG2.13(OT6)
DOT15: T3.3(P3) UDLDG2.12(OT7)
DOT16: T3.23(P23) UDLDG2.11(OT8)
DOT17: T2.23(P23) UDLDG3.18(OT1)
DOT18: T1.23(P23) UDLDG3.17(OT2)
DOT19: T1.4(P4) UDLDG3.16(OT3)
DOT20: T2.4(P4) UDLDG3.15(OT4)
DOT21: T3.4(P4) UDLDG3.14(OT5)
DOT22: T3.24(P24) UDLDG3.13(OT6)
DOT23: T2.24(P24) UDLDG3.12(OT7)
DOT24: T1.24(P24) UDLDG3.11(OT8)
DOT25: T1.5(P5) UDLDG4.18(OT1)
DOT26: T2.5(P5) UDLDG4.17(OT2)
DOT27: T3.5(P5) UDLDG4.16(OT3)
DOT28: T3.25(P25) UDLDG4.15(OT4)
DOT29: T2.25(P25) UDLDG4.14(OT5)
DOT30: T1.25(P25) UDLDG4.13(OT6)
DOT31: T1.6(P6) UDLDG4.12(OT7)
DOT32: T2.6(P6) UDLDG4.11(OT8)
DOT33: T3.6(P6) UDLDG5.18(OT1)
DOT34: T3.26(P26) UDLDG5.17(OT2)
DOT35: T2.26(P26) UDLDG5.16(OT3)
DOT36: T1.26(P26) UDLDG5.15(OT4)
DOT37: T1.7(P7) UDLDG5.14(OT5)
DOT38: T2.7(P7) UDLDG5.13(OT6)
DOT39: T3.7(P7) UDLDG5.12(OT7)
DOT40: T3.27(P27) UDLDG5.11(OT8)
DOT41: T2.27(P27) UDLDG6.18(OT1)
DOT42: T1.27(P27) UDLDG6.17(OT2)
DOT43: T1.8(P8) UDLDG6.16(OT3)
DOT44: T2.8(P8) UDLDG6.15(OT4)
DOT45: T3.8(P8) UDLDG6.14(OT5)
DOT46: T3.28(P28) UDLDG6.13(OT6)
DOT47: T2.28(P28) UDLDG6.12(OT7)
DOT48: T1.28(P28) UDLDG6.11(OT8)
DOT49: T1.9(P9) UDLDG7.18(OT1)
DOT50: T2.9(P9) UDLDG7.17(OT2)
DOT51: T3.9(P9) UDLDG7.16(OT3)
DOT52: T3.29(P29) UDLDG7.15(OT4)
DOT53: T2.29(P29) UDLDG7.14(OT5)
DOT54: T1.29(P29) UDLDG7.13(OT6)
DOT55: T1.10(P10) UDLDG7.12(OT7)
DOT56: T2.10(P10) UDLDG7.11(OT8)
DOT57: T3.10(P10) UDLDG8.18(OT1)
DOT58: T3.30(P30) UDLDG8.17(OT2)
DOT59: T2.30(P30) UDLDG8.16(OT3)
DOT60: T1.30(P30) UDLDG8.15(OT4)
DOT61: T1.11(P11) UDLDG8.14(OT5)
DOT62: T2.11(P11) UDLDG8.13(OT6)
DOT63: T3.11(P11) UDLDG8.12(OT7)
DOT64: T3.31(P31) UDLDG8.11(OT8)
DOT65: T2.31(P31) UDLDG9.18(OT1)
DOT66: T1.31(P31) UDLDG9.17(OT2)
DOT67: T1.12(P12) UDLDG9.16(OT3)
DOT68: T2.12(P12) UDLDG9.15(OT4)
DOT69: T3.12(P12) UDLDG9.14(OT5)
DOT70: T3.32(P32) UDLDG9.13(OT6)
DOT71: T2.32(P32) UDLDG9.12(OT7)
DOT72: T1.32(P32) UDLDG9.11(OT8)
DOT73: T1.13(P13) UDLDG10.18(OT1)
DOT74: T2.13(P13) UDLDG10.17(OT2)
DOT75: T3.13(P13) UDLDG10.16(OT3)
DOT76: T3.33(P33) UDLDG10.15(OT4)
DOT77: T2.33(P33) UDLDG10.14(OT5)
DOT78: T1.33(P33) UDLDG10.13(OT6)
DOT79: T1.14(P14) UDLDG10.12(OT7)
DOT80: T2.14(P14) UDLDG10.11(OT8)
DOT81: T3.14(P14) UDLDG11.18(OT1)
DOT82: T3.34(P34) UDLDG11.17(OT2)
DOT83: T2.34(P34) UDLDG11.16(OT3)
DOT84: T1.34(P34) UDLDG11.15(OT4)
DOT85: T1.15(P15) UDLDG11.14(OT5)
DOT86: T2.15(P15) UDLDG11.13(OT6)
DOT87: T3.15(P15) UDLDG11.12(OT7)
DOT88: T3.35(P35) UDLDG11.11(OT8)
DOT89: T2.35(P35) UDLDG12.18(OT1)
DOT90: T1.35(P35) UDLDG12.17(OT2)
DOT91: T1.16(P16) UDLDG12.16(OT3)
DOT92: T2.16(P16) UDLDG12.15(OT4)
DOT93: T3.16(P16) UDLDG12.14(OT5)
DOT94: T3.36(P36) UDLDG12.13(OT6)
DOT95: T2.36(P36) UDLDG12.12(OT7)
DOT96: T1.36(P36) UDLDG12.11(OT8)
DOT97: T1.17(P17) UDLDG13.18(OT1)
DOT98: T2.17(P17) UDLDG13.17(OT2)
DOT99: T3.17(P17) UDLDG13.16(OT3)
DOT100: T3.37(P37) UDLDG13.15(OT4)
DOT101: T2.37(P37) UDLDG13.14(OT5)
DOT102: T1.37(P37) UDLDG13.13(OT6)
DOT103: T1.18(P18) UDLDG13.12(OT7)
DOT104: T2.18(P18) UDLDG13.11(OT8)
DOT105: T3.18(P18) UDLDG14.18(OT1)
DOT106: T3.38(P38) UDLDG14.17(OT2)
DOT107: T2.38(P38) UDLDG14.16(OT3)
DOT108: T1.38(P38) UDLDG14.15(OT4)
DOT109: T1.19(P19) UDLDG14.14(OT5)
DOT110: T2.19(P19) UDLDG14.13(OT6)
DOT111: T3.19(P19) UDLDG14.12(OT7)
DOT112: T3.39(P39) UDLDG14.11(OT8)
DOT113: T2.39(P39) UDLDG15.18(OT1)
DOT114: T1.39(P39) UDLDG15.17(OT2)
DOT115: T1.20(P20) UDLDG15.16(OT3)
DOT116: T2.20(P20) UDLDG15.15(OT4)
DOT117: T3.20(P20) UDLDG15.14(OT5)
DOT118: T3.40(P40) UDLDG15.13(OT6)
DOT119: T2.40(P40) UDLDG15.12(OT7)
DOT120: T1.40(P40) UDLDG15.11(OT8)
DRY_BSY: R26.1 U10#1.6(RDY_BSY)
ETH_INT: U5.64(PI15/LCD_R0) U20.34(INT)
ETH_RST: R40.2 U5.65(PJ0/LCD_R1) U20.40(PWRST#)
F_CS: R14.2 U5.27(PF6/TIM10_CH1/SPI5_NSS/SAI1_SD_B/UART7_Rx/FMC_NIORD) U7.1(~{CS})
FMC_A0: U1.23(A0) U5.16(PF0/I2C2_SDA/FMC_A0)
FMC_A1: U1.24(A1) U5.17(PF1/I2C2_SCL/FMC_A1)
FMC_A2: U1.25(A2) U5.18(PF2/I2C2_SMBA/FMC_A2) U20.32(CMD)
FMC_A3: U1.26(A3) U5.22(PF3/FMC_A3)
FMC_A4: U1.29(A4) U5.23(PF4/FMC_A4)
FMC_A5: U1.30(A5) U5.24(PF5/FMC_A5)
FMC_A6: U1.31(A6) U5.71(PF12/FMC_A6)
FMC_A7: U1.32(A7) U5.74(PF13/FMC_A7)
FMC_A8: U1.33(A8) U5.75(PF14/FMC_A8)
FMC_A9: U1.34(A9) U5.76(PF15/FMC_A9)
FMC_A10: U1.22(A10) U5.77(PG0/FMC_A10)
FMC_A11: U1.35(A11) U5.78(PG1/FMC_A11)
FMC_A12: U1.36(A12/NC) U5.129(PG2/FMC_A12)
FMC_A16_CLE: U2.16(CLE) U5.111(PD11/USART3_CTS/FMC_A16)
FMC_A17_ALE: U2.17(ALE) U5.112(PD12/TIM4_CH1/USART3_RTS/FMC_A17)
FMC_BA0: U1.20(BA0) U5.131(PG4/FMC_A14/FMC_BA0)
FMC_BA1: U1.21(BA1) U5.132(PG5/FMC_A15/FMC_BA1)
FMC_D0: U1.2(DQ0) U2.29(I/O0) U5.116(PD14/TIM4_CH3/FMC_D0) U20.18(SD0)
FMC_D1: U1.4(DQ1) U2.30(I/O1) U5.117(PD15/TIM4_CH4/FMC_D1) U20.17(SD1)
FMC_D2: U1.5(DQ2) U2.31(I/O2) U5.164(PD0/CAN1_RX/FMC_D2) U20.16(SD2)
FMC_D3: U1.7(DQ3) U2.32(I/O3) U5.165(PD1/CAN1_TX/FMC_D3) U20.14(SD3)
FMC_D4: U1.8(DQ4) U2.41(I/O4) U5.79(PE7/TIM1_ETR/_UART7_Rx/_FMC_D4) U20.13(SD4)
FMC_D5: U1.10(DQ5) U2.42(I/O5) U5.80(PE8/TIM1_CH1N/UART7_Tx/FMC_D5) U20.12(SD5)
FMC_D6: U1.11(DQ6) U2.43(I/O6) U5.81(PE9/TIM1_CH1/FMC_D6) U20.11(SD6)
FMC_D7: U1.13(DQ7) U2.44(I/O7) U5.84(PE10/TIM1_CH2N/FMC_D7) U20.10(SD7)
FMC_D8: U1.42(DQ8) U5.85(PE11/TIM1_CH2/SPI4_NSS/FMC_D8/_LCD_G3) U20.31(SD8)
FMC_D9: U1.44(DQ9) U5.86(PE12/TIM1_CH3N/SPI4_SCK/_FMC_D9/_LCD_B4) U20.29(SD9)
FMC_D10: U1.45(DQ10) U5.87(PE13/TIM1_CH3/SPI4_MISO/FMC_D10/_LCD_DE) U20.28(SD10)
FMC_D11: U1.47(DQ11) U5.88(PE14/TIM1_CH4/SPI4_MOSI/FMC_D11/LCD_CLK) U20.27(SD11)
FMC_D12: U1.48(DQ12) U5.89(PE15/TIM1_BKIN/_FMC_D12/__LCD_R7) U20.26(SD12)
FMC_D13: U1.50(DQ13) U5.108(PD8/USART3_TX/FMC_D13) U20.25(SD13)
FMC_D14: U1.51(DQ14) U5.109(PD9/USART3_RX/FMC_D14) U20.24(SD14)
FMC_D15: U1.53(DQ15) U5.110(PD10/USART3_CK/FMC_D15/LCD_B3) U20.22(SD15)
FMC_NBL0: U1.15(LDQM) U5.200(PE0/TIM4_ETR/UART8_RX/FMC_NBL0/DCMI_D2)
FMC_NBL1: U1.39(UDQM) U5.201(PE1/UART8_Tx/FMC_NBL1/_DCMI_D3)
FMC_NCE3: R7.1 U2.9(~{CE}) U5.178(PG9/USART6_RX/FMC_NE2/FMC_NCE3)
FMC_NE1: R39.2 U20.37(CS#)
FMC_NOE: U2.8(~{RE}) U5.168(PD4/USART2_RTS/FMC_NOE) U20.35(IOR#)
FMC_NWAIT: U2.7(R/~{B}) U5.172(PD6/SPI3_MOSI/I2S3_SD/SAI1_SD_A/USART2_RX/FMC_NWAIT/DCMI_D10/LCD_B2)
FMC_NWE: U2.18(~{WE}) U5.169(PD5/USART2_TX/FMC_NWE) U20.36(IOW#)
FMC_SDCKE0: U1.37(CKE) U5.38(PC3/SPI2_MOSI/I2S2_SD/OTG_HS_ULPI_NXT/ETH_MII_TX_CLK/FMC_SDCKE0)
FMC_SDCLK: U1.38(CLK) U5.135(PG8/SPI6_NSS/_USART6_RTS/__ETH_PPS_OUT/_FMC_SDCLK)
FMC_SDNCAS: U1.17(~{CAS}) U5.191(PG15/USART6_CTS/_FMC_SDNCAS)
FMC_SDNE0: R6.1 U1.19(~{CS}) U5.37(PC2/SPI2_MISO/I2S2ext_SD/OTG_HS_ULPI_DIR/ETH_MII_TXD2/FMC_SDNE0)
FMC_SDNRAS: U1.18(~{RAS}) U5.70(PF11/SPI5_MOSI/FMC_SDNRAS/DCMI_D12)
FMC_SDNWE: U1.16(~{WE}) U5.35(PC0/OTG_HS_ULPI_STP/FMC_SDNWE)
FNSN: R100.1 U5.43(PA0/WKUP/UART4_TX/ETH_MII_CRS/ADC123_IN0)
GPIO0: U5.49(PH5/I2C2_SDA/SPI5_NSS/_FMC_SDNWE)
HALL1_IN: U5.8(PC13)
IIC_SCL: R12.2 U5.97(PH7/I2C3_SCL/_SPI5_MISO/__ETH_MII_RXD3/_FMC_SDCKE1/DCMI_D9) U8.6(SCL)
IIC_SDA: R13.2 U5.98(PH8/I2C3_SDA/_FMC_D16/_DCMI_HSYNC/_LCD_R2) U8.5(SDA)
JTCK-SWCLK: D23.1(A) P1.4 U5.159(PA14/JTCK-SWCLK)
JTMS-SWDIO: D22.1(A) P1.3 U5.147(PA13/JTMS-SWDIO)
KEY1: K1.2 P15.1 U5.2(PE3/TRACED0/SAI1_SD_B/FMC_A19)
KEY2: K2.2 U5.5(PE6/TRACED3/TIM9_CH2/SPI4_MOSI/SAI1_SD_A/FMC_A22/DCMI_D7/LCD_G1)
KEY3: K3.2 U5.11(PI9/CAN1_RX/_FMC_D30/_LCD_VSYNC)
KEY4: K4.2 U5.3(PE4/TRACED1/SPI4_NSS/SAI1_FS_A/FMC_A20/DCMI_D4/LCD_B0)
KEY5: K5.2 U5.4(PE5/TRACED2/_TIM9_CH1/SPI4_MISO/SAI1_SCK_A/FMC_A21/DCMI_D6/LCD_G0)
KEY6: K6.2 U5.12(PI10/ETH_MII_RX_ER/FMC_D31/LCD_HSYNC)
KEY7: U5.13(PI11/OTG_HS_ULPI_DIR)
LCD_B3: PLCD1.24 U5.177(PJ15/LCD_B3)
LCD_B4: PLCD1.25 U5.186(PK3/LCD_B4)
LCD_B5: PLCD1.26 U5.187(PK4/LCD_B5)
LCD_B6: PLCD1.27 U5.188(PK5/LCD_B6)
LCD_B7: PLCD1.28 U5.189(PK6/LCD_B7)
LCD_BL: PLCD1.34 U5.199(PB9/TIM4_CH4/TIM11_CH1/I2C1_SDA/SPI2_NSS/I2S2_WS/CAN1_TX/SDIO_D5/DCMI_D7/LCD_B7)
LCD_CLK: PLCD1.30 U5.21(PI14/LCD_CLK)
LCD_DE: PLCD1.33 U5.190(PK7/LCD_DE)
LCD_G2: PLCD1.14 U5.121(PJ9/LCD_G2)
LCD_G3: PLCD1.15 U5.122(PJ10/LCD_G3)
LCD_G4: PLCD1.16 U5.123(PJ11/LCD_G4)
LCD_G5: PLCD1.17 U5.126(PK0/LCD_G5)
LCD_G6: PLCD1.18 U5.127(PK1/LCD_G6)
LCD_G7: PLCD1.19 U5.128(PK2/LCD_G7)
LCD_HSYNC: PLCD1.31 U5.19(PI12/LCD_HSYNC)
LCD_R2: U5.66(PJ1/LCD_R2)
LCD_R3: PLCD1.6 U5.67(PJ2/LCD_R3)
LCD_R4: PLCD1.7 U5.68(PJ3/LCD_R4)
LCD_R5: PLCD1.8 U5.69(PJ4/LCD_R5)
LCD_R6: PLCD1.9 U5.95(PJ5/LCD_R6)
LCD_R7: PLCD1.10 U5.118(PJ6/LCD_R7)
LCD_RESET: R10.1 U5.48(PH4/I2C2_SCL/OTG_HS_ULPI_NXT)
LCD_RESIN: *R11.2 PLCD1.40 R10.2
LCD_VSYNC: PLCD1.32 U5.20(PI13/LCD_VSYNC)
MCLK: R22#2.2 U5.32(PH0/OSC_IN)
NRST: C1.2 D4.1 D18.1(A) D24.1(A) K7.1 P1.5 R1.2 U5.34(NRST)
RESET: U5.194(PB5/TIM3_CH2/I2C1_SMBA/SPI1_MOSI/SPI3_MOSI/I2S3_SD/CAN2_RX/OTG_HS_ULPI_D7/ETH_PPS_OUT/FMC_SDCKE1)
RESET_A: R?#2.2 U5.205(PI4/TIM8_BKIN/_FMC_NBL2/DCMI_D5/_LCD_B4)
SCQ_D1: U5.156(PI2/TIM8_CH4/_SPI2_MISO/__I2S2ext_SD/_FMC_D26/DCMI_D9/_LCD_G7) USCQ1.2(D1) USCQ2.2(D1) USCQ3.2(D1) USCQ4.2(D1) USCQ5.2(D1) USCQ6.2(D1) USCQ7.2(D1) USCQ8.2(D1) USCQ9.2(D1) USCQ10.2(D1) USCQ11.2(D1) USCQ12.2(D1) USCQ13.2(D1) USCQ14.2(D1) USCQ15.2(D1)
SCQ_D2: U5.155(PI1/SPI2_SCK/I2S2_CK(6)/__FMC_D25/DCMI_D8/__LCD_G6) USCQ1.3(D2) USCQ2.3(D2) USCQ3.3(D2) USCQ4.3(D2) USCQ5.3(D2) USCQ6.3(D2) USCQ7.3(D2) USCQ8.3(D2) USCQ9.3(D2) USCQ10.3(D2) USCQ11.3(D2) USCQ12.3(D2) USCQ13.3(D2) USCQ14.3(D2) USCQ15.3(D2)
SCQ_D3: U5.154(PI0/TIM5_CH4/__SPI2_NSS/I2S2_WS(6)/__FMC_D24/_DCMI_D13/__LCD_G5) USCQ1.4(D3) USCQ2.4(D3) USCQ3.4(D3) USCQ4.4(D3) USCQ5.4(D3) USCQ6.4(D3) USCQ7.4(D3) USCQ8.4(D3) USCQ9.4(D3) USCQ10.4(D3) USCQ11.4(D3) USCQ12.4(D3) USCQ13.4(D3) USCQ14.4(D3) USCQ15.4(D3)
SCQ_D4: U5.153(PH15/TIM8_CH3N/_FMC_D23/_DCMI_D11/_LCD_G4) USCQ1.5(D4) USCQ2.5(D4) USCQ3.5(D4) USCQ4.5(D4) USCQ5.5(D4) USCQ6.5(D4) USCQ7.5(D4) USCQ8.5(D4) USCQ9.5(D4) USCQ10.5(D4) USCQ11.5(D4) USCQ12.5(D4) USCQ13.5(D4) USCQ14.5(D4) USCQ15.5(D4)
SCQ_D5: U5.152(PH14/TIM8_CH2N/FMC_D22/DCMI_D4/_LCD_G3) USCQ1.6(D5) USCQ2.6(D5) USCQ3.6(D5) USCQ4.6(D5) USCQ5.6(D5) USCQ6.6(D5) USCQ7.6(D5) USCQ8.6(D5) USCQ9.6(D5) USCQ10.6(D5) USCQ11.6(D5) USCQ12.6(D5) USCQ13.6(D5) USCQ14.6(D5) USCQ15.6(D5)
SCQ_D6: U5.151(PH13/TIM8_CH1N/_CAN1_TX/FMC_D21/_LCD_G2) USCQ1.7(D6) USCQ2.7(D6) USCQ3.7(D6) USCQ4.7(D6) USCQ5.7(D6) USCQ6.7(D6) USCQ7.7(D6) USCQ8.7(D6) USCQ9.7(D6) USCQ10.7(D6) USCQ11.7(D6) USCQ12.7(D6) USCQ13.7(D6) USCQ14.7(D6) USCQ15.7(D6)
SCQ_D7: U5.141(PC9/MCO2/TIM3_CH4/TIM8_CH4/I2C3_SDA/I2S_CKIN/SDIO_D1/DCMI_D3) USCQ1.8(D7) USCQ2.8(D7) USCQ3.8(D7) USCQ4.8(D7) USCQ5.8(D7) USCQ6.8(D7) USCQ7.8(D7) USCQ8.8(D7) USCQ9.8(D7) USCQ10.8(D7) USCQ11.8(D7) USCQ12.8(D7) USCQ13.8(D7) USCQ14.8(D7) USCQ15.8(D7)
SCQ_D8: U5.140(PC8/TIM3_CH3/TIM8_CH3/USART6_CK/SDIO_D0/DCMI_D2) USCQ1.9(D8) USCQ2.9(D8) USCQ3.9(D8) USCQ4.9(D8) USCQ5.9(D8) USCQ6.9(D8) USCQ7.9(D8) USCQ8.9(D8) USCQ9.9(D8) USCQ10.9(D8) USCQ11.9(D8) USCQ12.9(D8) USCQ13.9(D8) USCQ14.9(D8) USCQ15.9(D8)
SCQ_LE1: U5.208(PI7/TIM8_CH3/FMC_D29/__DCMI_D7/LCD_B7) USCQ1.11(LE)
SCQ_LE2: U5.206(PI5/TIM8_CH1/_FMC_NBL3/DCMI_VSYNC/_LCD_B5) USCQ2.11(LE)
SCQ_LE3: U5.176(PJ14/LCD_B2,) USCQ3.11(LE)
SCQ_LE4: U5.174(PJ12/LCD_B0) USCQ4.11(LE)
SCQ_LE5: U5.104(PB12/TIM1_BKIN/_I2C2_SMBA/_SPI2_NSS/I2S2_WS/USART3_CK/_CAN2_RX/OTG_HS_ULPI_D5/ETH_MII_TXD0/ETH_RMI__I_TXD0/OTG_HS_ID)
SCQ_LE6: U5.157(PI3/TIM8_ETR/_SPI2_MOSI/I2S2_SD/_FMC_D27/_DCMI_D10) U5.173(PD7/USART2_CK/FMC_NE1/FMC_NCE2) USCQ6.11(LE)
SCQ_LE7: U5.167(PD3/SPI2_SCK/I2S2_CK/USART2_CTS/FMC_CLK/DCMI_D5) USCQ7.11(LE)
SCQ_LE8: U5.134(PG7/USART6_CK/_FMC_INT3/__DCMI_D13/_LCD_CLK) USCQ8.11(LE)
SCQ_LE9: U5.130(PG3/FMC_A13) USCQ9.11(LE)
SCQ_LE10: U5.119(PJ7/LCD_G0) USCQ10.11(LE)
SCQ_LE11: U5.105(PB13/TIM1_CH1N/SPI2_SCK/I2S2_CK/USART3_CTS/CAN2_TX/OTG_HS_ULPI_D6/ETH_MII_TXD1/ETH_RMI__I_TXD1) USCQ11.11(LE)
SCQ_LE12: U5.107(PB15/RTC_REFIN/TIM1_CH3N/TIM8_CH3N/SPI2_MOSI/I2S2_SD/TIM12_CH2/OTG_HS_DP) USCQ12.11(LE)
SCQ_LE13: U5.102(PH12/TIM5_CH3/_FMC_D20/_DCMI_D3/_LCD_R6) USCQ13.11(LE)
SCQ_LE14: U5.100(PH10/TIM5_CH1/FMC_D18/_DCMI_D1/LCD_R4) USCQ14.11(LE)
SCQ_LE15: U5.96(PH6/I2C2_SMBA/SPI5_SCK/__TIM12_CH1/ETH_MII_RXD2/FMC_SDNE1/DCMI_D8) USCQ15.11(LE)
SCQ_LE16: U5.1(PE2/TRACECLK/SPI4_SCK/SAI1_MCLK_A/ETH_MII_TXD3/FMC_A23)
SCQ_LE17: U5.207(PI6/TIM8_CH2,_FMC_D28/DCMI_D6/_LCD_B6)
SCQ_LE19: U5.175(PJ13/LCD_B1) USCQ5.11(LE)
SCQ_LE21: U5.160(PA15/JTDI/TIM2_CH1/TIM2_ETR/SPI1_NSS/SPI3_NSS/I2S3_WS)
SCQ_LE22: U5.142(PA8/MCO1/TIM1_CH1/_I2C3_SCL/USART1_CK/OTG_FS_SOF/LCD_R6)
SCQ_LE23: U5.138(PC6/TIM3_CH1/TIM8_CH1/_I2S2_MCK/USART6_TX/SDIO_D6/DCMI_D0/LCD_HSYNC)
SCQ_LE24: U5.133(PG6/FMC_INT2/_DCMI_D12)
SCQ_LE25: U5.120(PJ8/LCD_G1)
SCQ_LE26: U5.113(PD13/TIM4_CH2/_FMC_A18)
SCQ_LE27: U5.106(PB14/TIM1_CH2N/TIM8_CH2N/SPI2_MISO/I2S2ext_SD/USART3_RTS/TIM12_CH1/OTG_HS_DM)
SCQ_LE29: U5.101(PH11/TIM5_CH2/FMC_D19/_DCMI_D2/LCD_R5)
SCQ_LE30: U5.99(PH9/I2C3_SMBA/_TIM12_CH2/_FMC_D17/DCMI_D0/LCD_R3)
SCQ_Q1: UDLDG1.1(IN1) USCQ1.19(Q1)
SCQ_Q2: UDLDG1.2(IN2) USCQ1.18(Q2)
SCQ_Q3: UDLDG1.3(IN3) USCQ1.17(Q3)
SCQ_Q4: UDLDG1.4(IN4) USCQ1.16(Q4)
SCQ_Q5: UDLDG1.5(IN5) USCQ1.15(Q5)
SCQ_Q6: UDLDG1.6(IN6) USCQ1.14(Q6)
SCQ_Q7: UDLDG1.7(IN7) USCQ1.13(Q7)
SCQ_Q8: UDLDG1.8(IN8) USCQ1.12(Q8)
SCQ_Q9: UDLDG2.1(IN1) USCQ2.19(Q1)
SCQ_Q10: UDLDG2.2(IN2) USCQ2.18(Q2)
SCQ_Q11: UDLDG2.3(IN3) USCQ2.17(Q3)
SCQ_Q12: UDLDG2.4(IN4) USCQ2.16(Q4)
SCQ_Q13: UDLDG2.5(IN5) USCQ2.15(Q5)
SCQ_Q14: UDLDG2.6(IN6) USCQ2.14(Q6)
SCQ_Q15: UDLDG2.7(IN7) USCQ2.13(Q7)
SCQ_Q16: UDLDG2.8(IN8) USCQ2.12(Q8)
SCQ_Q17: UDLDG3.1(IN1) USCQ3.19(Q1)
SCQ_Q18: UDLDG3.2(IN2) USCQ3.18(Q2)
SCQ_Q19: UDLDG3.3(IN3) USCQ3.17(Q3)
SCQ_Q20: UDLDG3.4(IN4) USCQ3.16(Q4)
SCQ_Q21: UDLDG3.5(IN5) USCQ3.15(Q5)
SCQ_Q22: UDLDG3.6(IN6) USCQ3.14(Q6)
SCQ_Q23: UDLDG3.7(IN7) USCQ3.13(Q7)
SCQ_Q24: UDLDG3.8(IN8) USCQ3.12(Q8)
SCQ_Q25: UDLDG4.1(IN1) USCQ4.19(Q1)
SCQ_Q26: UDLDG4.2(IN2) USCQ4.18(Q2)
SCQ_Q27: UDLDG4.3(IN3) USCQ4.17(Q3)
SCQ_Q28: UDLDG4.4(IN4) USCQ4.16(Q4)
SCQ_Q29: UDLDG4.5(IN5) USCQ4.15(Q5)
SCQ_Q30: UDLDG4.6(IN6) USCQ4.14(Q6)
SCQ_Q31: UDLDG4.7(IN7) USCQ4.13(Q7)
SCQ_Q32: UDLDG4.8(IN8) USCQ4.12(Q8)
SCQ_Q33: UDLDG5.1(IN1) USCQ5.19(Q1)
SCQ_Q34: UDLDG5.2(IN2) USCQ5.18(Q2)
SCQ_Q35: UDLDG5.3(IN3) USCQ5.17(Q3)
SCQ_Q36: UDLDG5.4(IN4) USCQ5.16(Q4)
SCQ_Q37: UDLDG5.5(IN5) USCQ5.15(Q5)
SCQ_Q38: UDLDG5.6(IN6) USCQ5.14(Q6)
SCQ_Q39: UDLDG5.7(IN7) USCQ5.13(Q7)
SCQ_Q40: UDLDG5.8(IN8) USCQ5.12(Q8)
SCQ_Q41: UDLDG6.1(IN1) USCQ6.19(Q1)
SCQ_Q42: UDLDG6.2(IN2) USCQ6.18(Q2)
SCQ_Q43: UDLDG6.3(IN3) USCQ6.17(Q3)
SCQ_Q44: UDLDG6.4(IN4) USCQ6.16(Q4)
SCQ_Q45: UDLDG6.5(IN5) USCQ6.15(Q5)
SCQ_Q46: UDLDG6.6(IN6) USCQ6.14(Q6)
SCQ_Q47: UDLDG6.7(IN7) USCQ6.13(Q7)
SCQ_Q48: UDLDG6.8(IN8) USCQ6.12(Q8)
SCQ_Q49: UDLDG7.1(IN1) USCQ7.19(Q1)
SCQ_Q50: UDLDG7.2(IN2) USCQ7.18(Q2)
SCQ_Q51: UDLDG7.3(IN3) USCQ7.17(Q3)
SCQ_Q52: UDLDG7.4(IN4) USCQ7.16(Q4)
SCQ_Q53: UDLDG7.5(IN5) USCQ7.15(Q5)
SCQ_Q54: UDLDG7.6(IN6) USCQ7.14(Q6)
SCQ_Q55: UDLDG7.7(IN7) USCQ7.13(Q7)
SCQ_Q56: UDLDG7.8(IN8) USCQ7.12(Q8)
SCQ_Q57: UDLDG8.1(IN1) USCQ8.19(Q1)
SCQ_Q58: UDLDG8.2(IN2) USCQ8.18(Q2)
SCQ_Q59: UDLDG8.3(IN3) USCQ8.17(Q3)
SCQ_Q60: UDLDG8.4(IN4) USCQ8.16(Q4)
SCQ_Q61: UDLDG8.5(IN5) USCQ8.15(Q5)
SCQ_Q62: UDLDG8.6(IN6) USCQ8.14(Q6)
SCQ_Q63: UDLDG8.7(IN7) USCQ8.13(Q7)
SCQ_Q64: UDLDG8.8(IN8) USCQ8.12(Q8)
SCQ_Q65: UDLDG9.1(IN1) USCQ9.19(Q1)
SCQ_Q66: UDLDG9.2(IN2) USCQ9.18(Q2)
SCQ_Q67: UDLDG9.3(IN3) USCQ9.17(Q3)
SCQ_Q68: UDLDG9.4(IN4) USCQ9.16(Q4)
SCQ_Q69: UDLDG9.5(IN5) USCQ9.15(Q5)
SCQ_Q70: UDLDG9.6(IN6) USCQ9.14(Q6)
SCQ_Q71: UDLDG9.7(IN7) USCQ9.13(Q7)
SCQ_Q72: UDLDG9.8(IN8) USCQ9.12(Q8)
SCQ_Q73: UDLDG10.1(IN1) USCQ10.19(Q1)
SCQ_Q74: UDLDG10.2(IN2) USCQ10.18(Q2)
SCQ_Q75: UDLDG10.3(IN3) USCQ10.17(Q3)
SCQ_Q76: UDLDG10.4(IN4) USCQ10.16(Q4)
SCQ_Q77: UDLDG10.5(IN5) USCQ10.15(Q5)
SCQ_Q78: UDLDG10.6(IN6) USCQ10.14(Q6)
SCQ_Q79: UDLDG10.7(IN7) USCQ10.13(Q7)
SCQ_Q80: UDLDG10.8(IN8) USCQ10.12(Q8)
SCQ_Q81: UDLDG11.1(IN1) USCQ11.19(Q1)
SCQ_Q82: UDLDG11.2(IN2) USCQ11.18(Q2)
SCQ_Q83: UDLDG11.3(IN3) USCQ11.17(Q3)
SCQ_Q84: UDLDG11.4(IN4) USCQ11.16(Q4)
SCQ_Q85: UDLDG11.5(IN5) USCQ11.15(Q5)
SCQ_Q86: UDLDG11.6(IN6) USCQ11.14(Q6)
SCQ_Q87: UDLDG11.7(IN7) USCQ11.13(Q7)
SCQ_Q88: UDLDG11.8(IN8) USCQ11.12(Q8)
SCQ_Q89: UDLDG12.1(IN1) USCQ12.19(Q1)
SCQ_Q90: UDLDG12.2(IN2) USCQ12.18(Q2)
SCQ_Q91: UDLDG12.3(IN3) USCQ12.17(Q3)
SCQ_Q92: UDLDG12.4(IN4) USCQ12.16(Q4)
SCQ_Q93: UDLDG12.5(IN5) USCQ12.15(Q5)
SCQ_Q94: UDLDG12.6(IN6) USCQ12.14(Q6)
SCQ_Q95: UDLDG12.7(IN7) USCQ12.13(Q7)
SCQ_Q96: UDLDG12.8(IN8) USCQ12.12(Q8)
SCQ_Q97: UDLDG13.1(IN1) USCQ13.19(Q1)
SCQ_Q98: UDLDG13.2(IN2) USCQ13.18(Q2)
SCQ_Q99: UDLDG13.3(IN3) USCQ13.17(Q3)
SCQ_Q100: UDLDG13.4(IN4) USCQ13.16(Q4)
SCQ_Q101: UDLDG13.5(IN5) USCQ13.15(Q5)
SCQ_Q102: UDLDG13.6(IN6) USCQ13.14(Q6)
SCQ_Q103: UDLDG13.7(IN7) USCQ13.13(Q7)
SCQ_Q104: UDLDG13.8(IN8) USCQ13.12(Q8)
SCQ_Q105: UDLDG14.1(IN1) USCQ14.19(Q1)
SCQ_Q106: UDLDG14.2(IN2) USCQ14.18(Q2)
SCQ_Q107: UDLDG14.3(IN3) USCQ14.17(Q3)
SCQ_Q108: UDLDG14.4(IN4) USCQ14.16(Q4)
SCQ_Q109: UDLDG14.5(IN5) USCQ14.15(Q5)
SCQ_Q110: UDLDG14.6(IN6) USCQ14.14(Q6)
SCQ_Q111: UDLDG14.7(IN7) USCQ14.13(Q7)
SCQ_Q112: UDLDG14.8(IN8) USCQ14.12(Q8)
SCQ_Q113: UDLDG15.1(IN1) USCQ15.19(Q1)
SCQ_Q114: UDLDG15.2(IN2) USCQ15.18(Q2)
SCQ_Q115: UDLDG15.3(IN3) USCQ15.17(Q3)
SCQ_Q116: UDLDG15.4(IN4) USCQ15.16(Q4)
SCQ_Q117: UDLDG15.5(IN5) USCQ15.15(Q5)
SCQ_Q118: UDLDG15.6(IN6) USCQ15.14(Q6)
SCQ_Q119: UDLDG15.7(IN7) USCQ15.13(Q7)
SCQ_Q120: UDLDG15.8(IN8) USCQ15.12(Q8)
SDIO_CK: U5.163(PC12/SPI3_MOSI/I2S3_SD/USART3_CK/UART5_TX/SDIO_CK/DCMI_D9)
SDIO_CMD: U5.166(PD2/TIM3_ETR/UART5_RX/SDIO_CMD/DCMI_D11)
SDIO_D2: U5.161(PC10/SPI3_SCK/I2S3_CK/USART3_TX/UART4_TX/SDIO_D2/_DCMI_D8/LCD_R2)
SDIO_D3: U5.162(PC11/I2S3ext_SD/SPI3_MISO/USART3_RX/UART4_RX/SDIO_D3/DCMI_D4)
speed: U5.62(PB1/TIM1_CH3N/TIM3_CH4/TIM8_CH3N/LCD_R6/OTG_HS_ULPI_D2/ETH_MII_RXD3)
SPI5_MISO: U5.29(PF8/SPI5_MISO/SAI1_SCK_B/TIM13_CH1/FMC_NIOWR) U7.2(SO(IO1))
SPI5_MOSI: U5.30(PF9/SPI5_MOSI/_SAI1_FS_B/_TIM14_CH1/FMC_CD) U7.5(SI(IO0))
SPI5_SCK: U5.28(PF7/TIM11_CH1/SPI5_SCK/SAI1_MCLK_B/UART7_Tx/FMC_NREG) U7.6(CLK)
TP_CS: PLCD1.35 U5.180(PG11/ETH_MII_TX_EN/ETH_R__MII_TX_EN/_FMC_NCE4_2/_DCMI_D3/__LCD_B3)
TP_MISO: PLCD1.37 U5.181(PG12/SPI6_MISO/_USART6_RTS/_LCD_B4/__FMC_NE4/LCD_B1)
TP_MOSI: PLCD1.36 U5.183(PG14/SPI6_MOSI/_USART6_TX/__ETH_MII_TXD1/ETH_RMI__I_TXD1/FMC_A25)
TP_PEN: PLCD1.39 U5.46(PH2/ETH_MII_CRS/FMC_SDCKE0/_LCD_R0)
TP_SCK: PLCD1.38 U5.182(PG13/SPI6_SCK/__USART6_CTS/_ETH_MII_TXD0/ETH_RMI__I_TXD0/FMC_A24)
USART1_RX: U5.144(PA10/TIM1_CH3/USART1_RX/OTG_FS_ID/DCMI_D1) U9.2(TXD)
USART1_TX: U5.143(PA9/TIM1_CH2/_I2C3_SMBA/USART1_TX/DCMI_D0) U9.3(RXD)
USART2_RX: U5.50(PA3/TIM2_CH4/_TIM5_CH4/TIM9_CH2/USART2_RX/OTG_HS_ULPI_D0/_ETH_MII_COL/LCD_B5) WK1.2
USART2_TX: U5.45(PA2/USART2_TX/ETH_MDIO/ADC_IN2) WK1.1
USART3_RX: R25.1 U5.91(PB11/TIM2_CH4/I2C2_SDA/USART3_RX/OTG_HS_ULPI_D4/ETH_MII_TX_EN/ETH_RMII_TX_EN/LCD_G5) U10#1.7(UART1_RX)
USART3_TX: R24#1.1 U5.90(PB10/TIM2_CH3/I2C2_SCL/SPI2_SCK/I2S2_CK/USART3_TX/OTG_HS_ULPI_D3/ETH_MII_RX_ER) U10#1.8(UART1_TX)
USB_DM: C110.1 R102.1 U4.3(K2) U5.145(PA11/TIM1_CH4/_USART1_CTS/CAN1_RX/LCD_R4/OTG_FS_DM)
USB_DP: C112.1 R105.1 U5.146(PA12/TIM1_ETR/USART1_RTS/CAN1_TX/LCD_R5/OTG_FS_DP)
USB_UP: C113.1 R106.1 U4.4(K1)
USBDP: U4.5(K4)
WCLOCKRST: DS1.5(~{RST}) U5.198(PB8/TIM4_CH3/TIM10_CH1/I2C1_SCL/CAN1_RX/_ETH_MII_TXD3/SDIO_D4/DCMI_D6)
WCLOCKSCL: DS1.7(SCLK) U5.195(PB6/TIM4_CH1/I2C1_SCL/USART1_TX/CAN2_TX/FMC_SDNE1/DCMI_D5)
WCLOCKSDA: DS1.6(I/O) U5.196(PB7/TIM4_CH2/_I2C1_SDA/USART1_RX/FMC_NL/DCMI_VSYNC)
ZDIAN: U5.61(PB0/TIM1_CH2N/TIM3_CH3/TIM8_CH2N/_LCD_R3/OTG_HS_ULPI_D1/ETH_MII_RXD2)
ZFENG: U5.44(PA1/ETH_MII_RX_CLK/ETH_RMII_REF_CLK/ADC123_IN1)
Net*R15_2: *R15.2 U5.33(PH1/OSC_OUT)
Net*R16_2: *R16.2 R17.2 U5.203(PDR_ON)
Net*R19_2: *R19.2 C23.1 R18.2 U5.6(VBAT)
Net*R48_1: *R48.1 U20.21(EECS)
NetBOOT_3: BOOT.3 R4.1
NetBOOT_4: BOOT.4 R5.2
NetBT1_1: BT1.1 D59.1
NetC4_2: C4.2 C5.2 R8.1 U2.12(VCC) U2.37(VCC)
NetC19#2_1: C19#2.1 J2#2.5(SHELL) J2#2.6(SHELL) R24#2.1
NetC20_1: C20.1 L1.2 X1.1 X1.4(VCC)
NetC21_2: C21.2 U5.9(PC14/OSC32_IN) Y2.1
NetC22_1: C22.1 U5.10(PC15/OSC32_OUT) Y2.2
NetC25_2: C25.2 U5.92(VCAP1)
NetC26_1: C26.1 U5.148(VCAP2)
NetC46_2: C46.2 U11#1.5(VQ)
NetC47_2: C47.2 C48.2 R27.2 U11#1.9(VA)
NetC49_2: C49.2 U11#1.6(FILT+)
NetC50_1: C50.1 U11#1.10(AOUTR)
NetC50_2: C50.2 R32.1
NetC51_1: C51.1 U11#1.7(AOUTL)
NetC51_2: C51.2 R33.1
NetC52_2: C52.2 U12.2(VREF)
NetC53_1: C53.1 R32.2 U12.3(INP)
NetC54_1: C54.1 R33.2 U12.4(INN)
NetC55_2: C55.2 C56.2 C57.2 C?.1 R36.1 U12.6(VDD)
NetC58_2: C58.2 J2#1.2 R37.2
NetC59_2: C59.2 J2#1.1 R38.2
NetC63_2: C63.2 R42.1 R43.1
NetC64_2: C64.2 R44.1 R45.1
NetC65_2: C65.2 C66.2 CE1.1 J3.4 J3.5 U20.2(AVDD25) U20.9(AVDD25)
NetC72_1: C72.1 D3.2(K) L3.1 U10#2.6(SW)
NetC72_2: C72.2 U10#2.1(BST)
NetC80_2: C80.2 U9.4(V3)
NetC81_2: C81.2 U9.7(XI) Y4.1(OSC1)
NetC82_2: C82.2 U9.8(XO) Y4.2(OSC2)
NetCD1_2: CD1.2 DS1.2(X1) Y1.2(OSC2)
NetCD2_2: CD2.2 DS1.3(X2) Y1.1(OSC1)
NetD2_2: D2.2(K) L2.2 U11#2.2(out)
NetD4_2: D4.2 Q2.3(C) R23.2
NetFB1_1: FB1.1 P1.1
NetJ2#2_2: J2#2.2(D-) R102.2
NetJ2#2_3: J2#2.3(D+) R105.2 R106.2
NetJ3_9: J3.9(L+) R50.1
NetJ3_11: J3.11(R-) R49.1
NetLED1_2: LED1.2 R26.2
NetLED2_2: LED2.2 R25.2
NetLED3_2: LED3.2 R24#1.2
NetP18_2: P18.2 Q5.3(C)
NetQ1_2: Q1.2(B) Q2.1(E) R20.2
NetQ1_3: Q1.3(C) R22#1.1
NetQ2_2: Q2.2(B) R21.2
NetQ5_2: Q5.2(B) R100.2
NetQ?_1: Q?.1(B) R?#1.1 R?#2.1
NetQ?_3: Q?.3(C) R?#3.1
NetR9_1: R9.1 U2.19(~{WP})
NetR20_1: R20.1 U9.14(RTS#)
NetR21_1: R21.1 U9.13(DTR#)
NetR22#2_1: R22#2.1 X1.3
NetR28_1: R28.1 U10#1.25(I2S_D0)
NetR28_2: R28.2 U11#1.1(SDATA)
NetR29_1: R29.1 U10#1.24(I2S_BCLK)
NetR29_2: R29.2 R?#4.2 U11#1.2(SCLK)
NetR30_1: R30.1 U10#1.23(I2S_FCLK)
NetR30_2: R30.2 U11#1.3(LRCK)
NetR31_1: R31.1 U10#1.22(I2S_MCLK)
NetR31_2: R31.2 U11#1.4(MCLK)
NetR34_1: R34.1 R35.2
NetR34_2: R34.2 U12.1(SD)
NetR37_1: R37.1 U12.8(VON)
NetR38_1: R38.1 U12.5(VOP)
NetR41_1: R41.1 U20.44(X1)
NetR41_2: R41.2 X2.3(C)
NetR46_2: R46.2 U20.1(BGRES)
NetR47_1: R47.1 U20.20(EECK)
NetR52_1: R52.1 R53.1 U11#2.4(feeddack)
NetR54_1: R54.1 U10#2.4(EN)
NetR55_1: R55.1 R56.2 R57.2 U10#2.3(FB)
NetR?#3_2: R?#3.2 U10#1.9(RESET)

Not connected (* = marked no-connect by the designer): *R11 1*; *R15 1; DC1 3; P16 1; U3 1(TP) 3(~{SLEEP}) 5(TP) 7(NC) 8(NC); U5 0 31(PF10/FMC_INTR/DCMI_D11/__LCD_DE) 47(PH3/ETH_MII_COL/FMC_SDNE0/_LCD_R1) 139(PC7/TIM3_CH2/TIM8_CH2/I2S3_MCK/USART6_RX/SDIO_D7/DCMI_D1) 179(PG10/LCD_G3/_FMC_NCE4_1/FMC_NE3/DCMI_D2/_LCD_B2) 192(PB3/JTDO/TRACESWO/TIM2_CH2/SPI1_SCK/SPI3_SCK/I2S3_CK); U9 9(CTS#) 10(DSR#) 11(RI#) 12(DCD#) 15(R232); U10#1 3(CLASSDP) 4(CLASSDN) 10(I2C2_SCL) 11(I2C2_SDA) 13(SPI2_CLK) 14(SPI2_CS) 15(SPI2_MISO) 16(SPI2_MOSI) 18(USB_DP) 19(USB_DM) 21(AUDIO_MUTE) 27(SWCLK) 28(SWDIO) 29(DEBUG_RX) 30(DEBUG_TX) 31(UART0_RX) 32(UART0_TX); U20 19(EEDIO) 43(X2) 46(SD); USB_1 2(D-) 3(D+); USB_2 5 6

## Notes on the sheet
- BOOT
- (near U1) SDRAM
- BOOT1   BOOT0   启动模式
- (near U2) NAND FLASH
- TFT LCD接口(RGB)
- (near R1) RESET
- X             0         主闪存存储器
- 0              1         系统存储器
- 1              1         内置SRAM
- RTC 外
- FPC-40P-0.5 翻盖插座
- 内部看门狗
- 等长布线
- 液晶数据缓存
- (near U8) EEPROM
- (near U7) SPI FLASH
- 3.3V参考电压（用于ADC）
- (near FB6) 模拟电压
- 3.3V参考
- (near U8) AT24C64是存储器容量为
- (near U8) AT24C02是一个2K位串行CMOS E
- (near U7) SPI FLASH 32M 字
- 存储配置数据等如温度校正值
- 存储日志,曲线等看情况使用
- 风机控制
- (near U5) MCU
- 3.3V有源，主
- MCLK
- DEBUG
- PRINTF
- (0~150mA)输出1
- (0~150mA)输出2
- 空，备用
- (near L1) 3.3V有源，主时钟倍频
- (5mV/°C)温度2
- (5mV/°C)温度3
- U盘串口
- USB串口，USB下载口
- TIM4 CH4 PWM 液晶背光
- (near U5) 按键5
- (near U5) 按键6
- (near U5) 按键7
- NET(MAC+PHY)
- FSMC_NE4，地址A2控制命令数据
- addr reg : 0x6C000000
- data reg : 0x6C000008
- USB接口
- 信号检测入
- RTC CLK
- 选择3.3V有源晶振注意管脚。
- 安装电阻：网卡工作在8位模式；否则为16位模式
- 安装电阻：网卡中断低有效；否则高有效
- 默认R47焊接，R48不焊，中断低16位模式
- (near YM1) ESD保护看场合,建议这些加上。
- 按键1
- 按键3
- 按键2
- 注意：DM9000的复位脚最好单独控制，否则可能上电不正常
- (near U20) ETH
- 按键4
- (near *R16) 不贴
- (near R18) RTC VBAT
- 不贴
- 默认*R16不焊接,R17焊接
- 目前工作模式是读取片外时钟，设置片内时钟，所以片内RTC不需要断电保持。
- R18焊接时,*R19不能焊接,
- Labels drawn without touching a wire or pin: AC1_IN, AUDIO_MUTE, BY1_IN, CH340 D+, CH340 D-, DH1_IN, DH2_IN, FMC_A18, FMC_NE1, GPIO2, IO2_IN, IO3_IN, IO6_IN, JDQ1, JDQ2, JDQ3, JDQ4, JDQ5, JDQ6, KEY2, LCD_B0, LCD_B1, LCD_B2, LCD_G0, LCD_G1, LED1, LED2, LED3, LED4, LED5, LED6, SD_DETECT, SPKL, SPKN, USART6_RX, USART6_TX
- (in symbol HR911105A 1) TD+; 1 TX+; TD-; 2 TX-; RD+; 3 RX+; RD-; 6 RX-; Green; 7; 8; Yellow; ETH

## Library data of the parts
*R11 *R15 *R16 *R19 *R48 R1-R3 R6-R10 R12-R14 R17 R18 R24#2 R39-R47 R49-R51 R102 R105 R106 = RES2
BOOT = Header 3X2: Header, 3-Pin, Dual row; LatestRevisionDate: 17-Jul-2002; LatestRevisionNote: Re-released for DXP Platform.; Publisher: Altium Limited
BT1 = BATTERY
C1-C18 C19#1 C19#2 C21-C43 C60-C68 C110 C112 C113 CD1 CD2 CV1 = CAP: Capacitor
C20 C44-C52 C55-C59 = Cap S1: 1nF; LatestRevisionDate: 17-Jul-2002; LatestRevisionNote: Re-released for DXP Platform.; PackageReference: C1206; Published: 8-Jun-2000; Publisher: Altium Limited
C53 = Cap NP: 电容; Published: 8-Jun-2000; LatestRevisionDate: 17-Jul-2002; LatestRevisionNote: Re-released for DXP Platform.; Publisher: Altium Limited
C54 C78-C83 = C
C71-C73 = Cap: Capacitor; Published: 8-Jun-2000; LatestRevisionDate: 17-Jul-2002; LatestRevisionNote: Re-released for DXP Platform.; PackageReference: RAD-0.3; Publisher: Altium Limited; PackageDescription: Radial Cap, Thru-Hole; 2 Leads; 0.3 in Pin Spacing
C? = CAP1: 10uF/16V
CA1 CA2 CE1 = ELECTRO2: Electrolytic Capacitor
CE2-CE5 = CAP3: Value: 220uF/35V
D2 D3 = Diode: Default Diode; Published: 8-Jun-2000; LatestRevisionDate: 17-Jul-2002; LatestRevisionNote: Re-released for DXP Platform.; PackageVersion: Sep-1996; PackageReference: SMC; Publisher: Altium Limited; PackageDescription: DO-214-AB/SMC; 2 C-Bend Leads; Body 7.9 x 5.9 mm, inc. leads (LxW); Code_JEDEC: DO-214-AB
D4 = D
D18 D22-D24 = ZENER2: Zener Diode
D60 = DIODE SCHOTTKY: Schottky Diode
DC1 = DC-005-25A: BOM_Manufacturer: HRO; Contributor: LCSC; BOM_Supplier: LCSC; BOM_Manufacturer Part: DC-005-25A; BOM_Supplier Part: C136715; spicePre: D; spiceSymbolName: DC-005-25A
FB1 FB6 FB7 = 120 OHM/2A@100MHz: BOM_Manufacturer: MuRata; BOM_Manufacturer Part: BLM18PG121SN1D; nameAlias: Value; BOM_Supplier: LCSC; BOM_Supplier Part: C73100; BOM_LCSC Assembly: Yes; spicePre: L; spiceSymbolName: BLM18PG121SN1D
FB8 FB9 = 120 OHM/3A@100MHz: BOM_Manufacturer: MuRata; BOM_Manufacturer Part: BLM21PG121SN1D; nameAlias: Value; BOM_Supplier: LCSC; BOM_Supplier Part: C79382; spicePre: L; spiceSymbolName: BLM21PG121SN1D
FB10 = INDUCTOR
J2#2 = USB-B
J3 = HR911105A 1
L1 = INDUCTOR1: INDUCTOR
L2 L3 = Inductor: Code_IEC: 1005; Published: 8-Jun-2000; LatestRevisionDate: 29-May-2009; LatestRevisionNote: IPC-7351 Footprint Added.; PackageReference: 0402-A; Publisher: Altium Limited; PackageDescription: Chip Inductor; Code_JEITA: 0402
LED1-LED3 = LED-S
P1 = CON5: Connector
P5 = Header 3: Header, 3-Pin; LatestRevisionDate: 17-Jul-2002; LatestRevisionNote: Re-released for DXP Platform.; Publisher: Altium Limited
P6-P11 P15 P16 P18 = CON2: Connector
Q1 = PNP: 8550/BCW68
Q2 Q5 = NPN: 8050/BCW846/BCW847
Q? = 2SC8550: PNP SOT23; Published: 8-Jun-2000; LatestRevisionDate: 15-Jan-2003; LatestRevisionNote: PCB Footprint 'BCY-W3/D4.7' replaced; DatasheetDocument: 1997; PackageDocument: Sep-1998; PackageReference: TO-92A; Publisher: Altium Limited; Code_JEDEC: TO-92A; ComponentLink1Description: Manufacturer Link; ComponentLink1URL: http://www.fairchildsemi.com/; ComponentLink2Description: Datasheet; ComponentLink2URL: http://www.fairchildsemi.com/ds/2N%2F2N3906.pdf
R4 R5 R20 R21 R22#1 R23 = R
R32 R33 = RES
R52-R57 = Res2: Resistor; Published: 8-Jun-2000; LatestRevisionDate: 17-Jul-2002; LatestRevisionNote: Re-released for DXP Platform.; PackageReference: AXIAL-0.4; Publisher: Altium Limited; PackageDescription: Axial Device, Thru-Hole; 2 Leads; 0.4 in Pin Spacing
U1 = IS42S16160B: 32MB SDRAM
U2 = K9F2G08U0C: 256MB NAND FLASH
U3 = REF195ES
U4 = SP504: 二极管
U7 = W25Q128
U8 = 24C256: EEPROM
U9 = CH340G: USB2UART
U11#2 = LM2576-ADJ
USB_1 = USB5
USCQ1-USCQ15 = SN74HC573DW: Octal D-Type Transparent Latch with 3-State Outputs; Published: 8-Jun-2000; LatestRevisionDate: 13-Apr-2006; LatestRevisionNote: IPC-7351 Footprint Added.; DatasheetVersion: Jun-1989; PackageVersion: Mar-2000; PackageReference: DW020; Publisher: Altium Limited; PackageDescription: 20-Pin Plastic Small Outline Integrated Circuit 1.27 mm Pitch; Code_JEDEC: MS-013; Code_IPC: SOIC127P1030-20; ComponentLink1Description: Manufacturer Link; ComponentLink1URL: http://www.ti.com/
X1 = XTAL_SM: Crystal
X2 = POWER_CRYSTAL
Y1 = XTAL: Crystal Oscillator; Published: 8-Jun-2000; LatestRevisionDate: 17-Jul-2002; LatestRevisionNote: Re-released for DXP Platform.; PackageReference: R38; Publisher: Altium Limited
Y2 = CRYSTAL2
Y4 = XTAL_2: Crystal Oscillator; Published: 8-Jun-2000; LatestRevisionDate: 17-Jul-2002; LatestRevisionNote: Re-released for DXP Platform.; Publisher: Altium Limited
YM1 = YMDR
R22#2 R24#1 R25-R31 R34-R38 R100 R?#1-R?#4 = R1-S: Published: 8-Jun-2000; LatestRevisionDate: 17-Jul-2002; LatestRevisionNote: Re-released for DXP Platform.; PackageReference: AXIAL-0.5; Publisher: Altium Limited